# EAGLE design quadcopter (EAGLE 9.7.0)
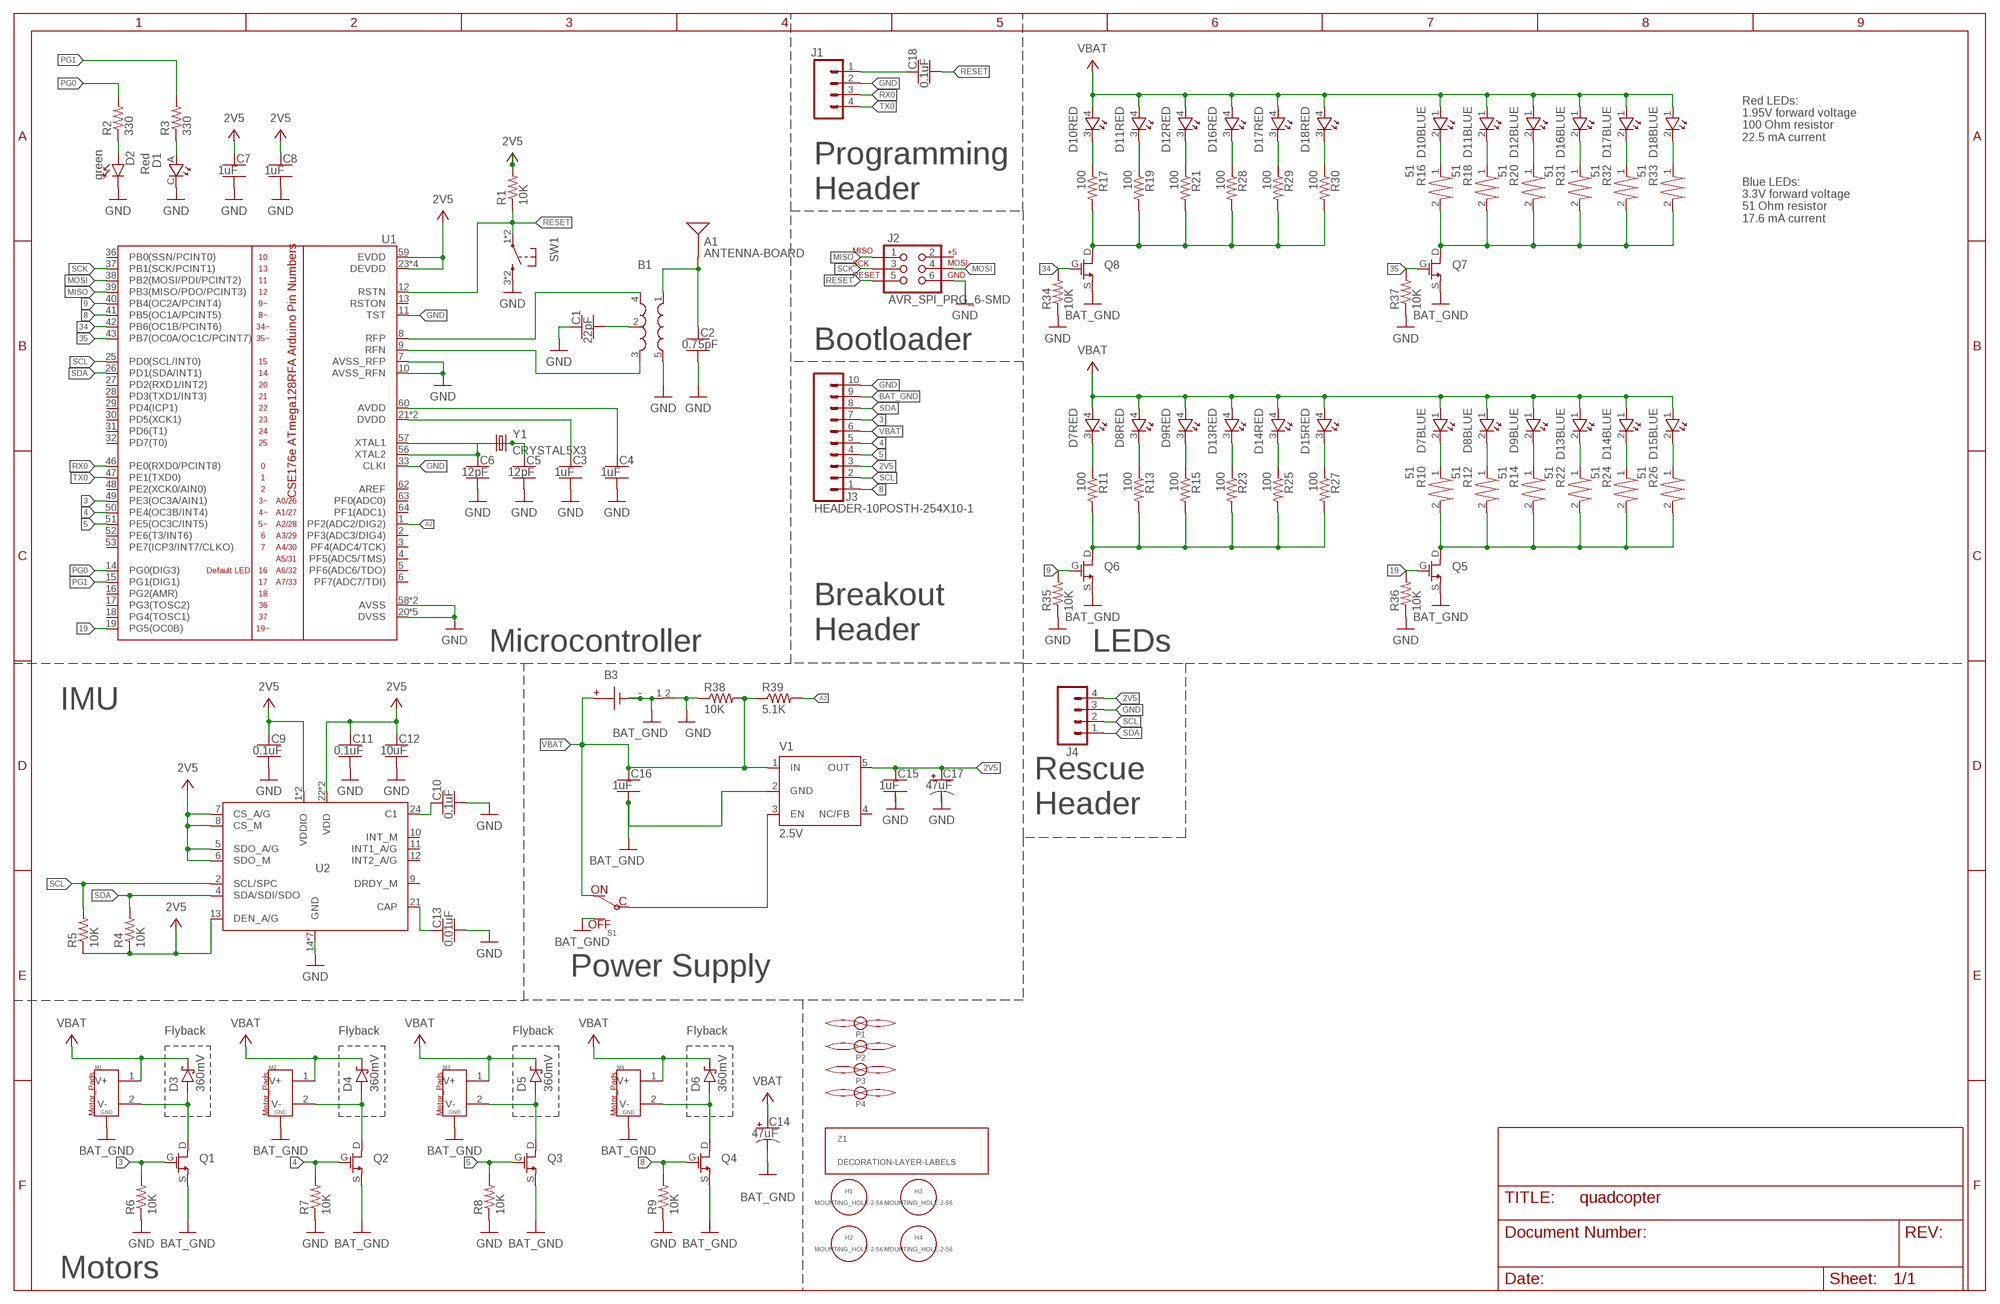
[diagram p0: schematic, sheet 1]
FRAME1 (FRAME_B_L): CREATOR: Unknown; DIST: Unknown; DISTPN: Unknown

## Parts
A1  ANTENNA-BOARD  [ANT_PCB_2.4GHZ_NRF8001_1.6MM_1OZ]
B1  BALUN0805  [BALUN]
B3  BATTERY-SMD-TH  [BATTERY-COMBO]
C1  22pF  CAPACITOR-NP_SMD-2012-0805_CERAMIC-22PF  [CAPC2012X140_HS]
C2  0.75pF  CAPACITOR-NP_SMD-2012-0805_CERAMIC-0.75PF  [CAPC2012X140_HS]
C3  1uF  CAPACITOR-NP_SMD-2012-0805_CERAMIC-1UF  [CAPC2012X140_HS]
C4  1uF  CAPACITOR-NP_SMD-2012-0805_CERAMIC-1UF  [CAPC2012X140_HS]
C5  12pF  CAPACITOR-NP_SMD-2012-0805_CERAMIC-12PF  [CAPC2012X140_HS]
C6  12pF  CAPACITOR-NP_SMD-2012-0805_CERAMIC-12PF  [CAPC2012X140_HS]
C7  1uF  CAPACITOR-NP_SMD-2012-0805_CERAMIC-1UF  [CAPC2012X140_HS]
C8  1uF  CAPACITOR-NP_SMD-2012-0805_CERAMIC-1UF  [CAPC2012X140_HS]
C9  0.1uF  CAPACITOR-NP_SMD-2012-0805_CERAMIC-0.1UF  [CAPC2012X140_HS]
C10  0.1uF  CAPACITOR-NP_SMD-2012-0805_CERAMIC-0.1UF  [CAPC2012X140_HS]
C11  0.1uF  CAPACITOR-NP_SMD-2012-0805_CERAMIC-0.1UF  [CAPC2012X140_HS]
C12  10uF  CAPACITOR-NP_SMD-2012-0805_CERAMIC-10UF  [CAPC2012X140_HS]
C13  0.01uF  CAPACITOR-NP_SMD-2012-0805_CERAMIC-0.01UF  [CAPC2012X140_HS]
C14  47uF  CAPACITOR-POL_47UF-SMD-1206-TAJA  [CAPMP3216X180]
C15  1uF  CAPACITOR-NP_SMD-2012-0805_CERAMIC-1UF  [CAPC2012X140_HS]
C16  1uF  CAPACITOR-NP_SMD-2012-0805_CERAMIC-1UF  [CAPC2012X140_HS]
C17  47uF  CAPACITOR-POL_47UF-SMD-1206-TAJA  [CAPMP3216X180]
C18  0.1uF  CAPACITOR-NP_SMD-2012-0805_CERAMIC-0.1UF  [CAPC2012X140_HS]
D1  Red  LED-RED-0805  [0805_LED]
D2  green  DIODE-LED_SMD-2012-0805-GREEN  [LEDSC125X200X120-2_HS]
D3  360mV  DIODE-SCHOTTKY_-SMD-SOD123  [SODFL3516X96]
D4  360mV  DIODE-SCHOTTKY_-SMD-SOD123  [SODFL3516X96]
D5  360mV  DIODE-SCHOTTKY_-SMD-SOD123  [SODFL3516X96]
D6  360mV  DIODE-SCHOTTKY_-SMD-SOD123  [SODFL3516X96]
D7  DUAL_LED0805_RB_LED  [0805_RB_LED]
D8  DUAL_LED0805_RB_LED  [0805_RB_LED]
D9  DUAL_LED0805_RB_LED  [0805_RB_LED]
D10  DUAL_LED0805_RB_LED  [0805_RB_LED]
D11  DUAL_LED0805_RB_LED  [0805_RB_LED]
D12  DUAL_LED0805_RB_LED  [0805_RB_LED]
D13  DUAL_LED0805_RB_LED  [0805_RB_LED]
D14  DUAL_LED0805_RB_LED  [0805_RB_LED]
D15  DUAL_LED0805_RB_LED  [0805_RB_LED]
D16  DUAL_LED0805_RB_LED  [0805_RB_LED]
D17  DUAL_LED0805_RB_LED  [0805_RB_LED]
D18  DUAL_LED0805_RB_LED  [0805_RB_LED]
H1  MOUNTING_HOLE-2-56  [2-56-MOUNTING-HOLE-NO-METAL]
H2  MOUNTING_HOLE-2-56  [2-56-MOUNTING-HOLE-NO-METAL]
H3  MOUNTING_HOLE-2-56  [2-56-MOUNTING-HOLE-NO-METAL]
H4  MOUNTING_HOLE-2-56  [2-56-MOUNTING-HOLE-NO-METAL]
J1  HEADER-4POS-0.1IN-FEMALE-SMD-BOTTOM-ENTRY  [HEADER-1X4-BOTTOM-ENTRY]
J2  AVR_SPI_PRG_6-SMD  [2X3-SMD]
J3  HEADER-10POSTH-254X10-1  [HDRV10W63P254_10X1_2540X254H838_HS]
J4  HEADER-4POS-0.1IN-FEMALE  [HDRVR4W80P254_1X4_1066X254X850B]
M1  MOTOR_PADS_GND-MOLEX-SMD  [MOLEX-0532610271]
M2  MOTOR_PADS_GND-MOLEX-SMD  [MOLEX-0532610271]
M3  MOTOR_PADS_GND-MOLEX-SMD  [MOLEX-0532610271]
M4  MOTOR_PADS_GND-MOLEX-SMD  [MOLEX-0532610271]
P1  PROPELLOR-45MM  [MOTOR_AND_PROP]
P2  PROPELLOR-45MM  [MOTOR_AND_PROP]
P3  PROPELLOR-45MM  [MOTOR_AND_PROP]
P4  PROPELLOR-45MM  [MOTOR_AND_PROP]
Q1  NMOSFETSI2302CDS-T1-E3CT-ND  [SOT23_MOSFET]
Q2  NMOSFETSI2302CDS-T1-E3CT-ND  [SOT23_MOSFET]
Q3  NMOSFETSI2302CDS-T1-E3CT-ND  [SOT23_MOSFET]
Q4  NMOSFETSI2302CDS-T1-E3CT-ND  [SOT23_MOSFET]
Q5  NMOSFETSI2302CDS-T1-E3CT-ND  [SOT23_MOSFET]
Q6  NMOSFETSI2302CDS-T1-E3CT-ND  [SOT23_MOSFET]
Q7  NMOSFETSI2302CDS-T1-E3CT-ND  [SOT23_MOSFET]
Q8  NMOSFETSI2302CDS-T1-E3CT-ND  [SOT23_MOSFET]
R1  10K  RESISTOR_SMD-2012-0805-10K  [RESC2012X60_HS]
R2  330  RESISTOR_SMD-2012-0805-330  [RESC2012X60_HS]
R3  330  RESISTOR_SMD-2012-0805-330  [RESC2012X60_HS]
R4  10K  RESISTOR_SMD-2012-0805-10K  [RESC2012X60_HS]
R5  10K  RESISTOR_SMD-2012-0805-10K  [RESC2012X60_HS]
R6  10K  RESISTOR_SMD-2012-0805-10K  [RESC2012X60_HS]
R7  10K  RESISTOR_SMD-2012-0805-10K  [RESC2012X60_HS]
R8  10K  RESISTOR_SMD-2012-0805-10K  [RESC2012X60_HS]
R9  10K  RESISTOR_SMD-2012-0805-10K  [RESC2012X60_HS]
R10  51  RESISTOR-0805-51OHM  [0805_RESISTOR]
R11  100  RESISTOR_SMD-2012-0805-100  [RESC2012X60_HS]
R12  51  RESISTOR-0805-51OHM  [0805_RESISTOR]
R13  100  RESISTOR_SMD-2012-0805-100  [RESC2012X60_HS]
R14  51  RESISTOR-0805-51OHM  [0805_RESISTOR]
R15  100  RESISTOR_SMD-2012-0805-100  [RESC2012X60_HS]
R16  51  RESISTOR-0805-51OHM  [0805_RESISTOR]
R17  100  RESISTOR_SMD-2012-0805-100  [RESC2012X60_HS]
R18  51  RESISTOR-0805-51OHM  [0805_RESISTOR]
R19  100  RESISTOR_SMD-2012-0805-100  [RESC2012X60_HS]
R20  51  RESISTOR-0805-51OHM  [0805_RESISTOR]
R21  100  RESISTOR_SMD-2012-0805-100  [RESC2012X60_HS]
R22  51  RESISTOR-0805-51OHM  [0805_RESISTOR]
R23  100  RESISTOR_SMD-2012-0805-100  [RESC2012X60_HS]
R24  51  RESISTOR-0805-51OHM  [0805_RESISTOR]
R25  100  RESISTOR_SMD-2012-0805-100  [RESC2012X60_HS]
R26  51  RESISTOR-0805-51OHM  [0805_RESISTOR]
R27  100  RESISTOR_SMD-2012-0805-100  [RESC2012X60_HS]
R28  100  RESISTOR_SMD-2012-0805-100  [RESC2012X60_HS]
R29  100  RESISTOR_SMD-2012-0805-100  [RESC2012X60_HS]
R30  100  RESISTOR_SMD-2012-0805-100  [RESC2012X60_HS]
R31  51  RESISTOR-0805-51OHM  [0805_RESISTOR]
R32  51  RESISTOR-0805-51OHM  [0805_RESISTOR]
R33  51  RESISTOR-0805-51OHM  [0805_RESISTOR]
R34  10K  RESISTOR_SMD-2012-0805-10K  [RESC2012X60_HS]
R35  10K  RESISTOR_SMD-2012-0805-10K  [RESC2012X60_HS]
R36  10K  RESISTOR_SMD-2012-0805-10K  [RESC2012X60_HS]
R37  10K  RESISTOR_SMD-2012-0805-10K  [RESC2012X60_HS]
R38  10K  RESISTOR_SMD-2012-0805-10K  [RESC2012X60_HS]
R39  5.1K  RESISTOR_SMD-2012-0805-5.1K  [RESC2012X60_HS]
S1  POWER-SWITCH-MFS201N-9-Z-SMD-EDGE  [JS102011SAQN]
SW1  PUSHBUTTON_-4.5X4.5  [4.5MM_TACTILE_SWITCH_TL3305AF160QG]
U1  ATMEGA128RFA1  [QFN-64]
U2  IMU_LSM9DS1LSM9DS1  [IMU_LSM9DS1]
V1  2.5V  TPS73633-DBVT2.5V  [SOT23-DBV]
W1  NET_BRIDGENET_BRIDGE  [NET_BRIDGE]
Y1  CRYSTAL5X3  [CRYSTAL-SMD-5X3]
Z1  DECORATION-LAYER-LABELS  [LAYER_LABELS]

## Nets
2V5 [PWR]: C7.1 C8.1 C9.1 C11.1 C12.1 C15.1 C17.1(+) J3.3 J4.4 R1.2 R4.1 R5.1 U1.23(DEVDD) U1.34(DEVDD) U1.44(DEVDD) U1.54(DEVDD) U1.59(EVDD) U2.1(VDDIO) U2.3(VDDIO) U2.5(SDO_A/G) U2.6(SDO_M) U2.7(CS_A/G) U2.8(CS_M) U2.13(DEN_A/G) U2.22(VDD) U2.23(VDD) V1.5(OUT)
3: J3.7 Q1.G R6.2 U1.49(PE3(OC3A/AIN1))
4: J3.5 Q2.G R7.2 U1.50(PE4(OC3B/INT4))
5: J3.4 Q3.G R8.2 U1.51(PE5(OC3C/INT5))
8: J3.1 Q4.G R9.2 U1.41(PB5(OC1A/PCINT5))
9: Q6.G R35.2 U1.40(PB4(OC2A/PCINT4))
19: Q5.G R36.2 U1.19(PG5(OC0B))
34: Q8.G R34.2 U1.42(PB6(OC1B/PCINT6))
35: Q7.G R37.2 U1.43(PB7(OC0A/OC1C/PCINT7))
A2: R39.2 U1.1(PF2(ADC2/DIG2))
ADRV [RFSIG]: A1.FEED(SIGNAL) B1.1(IN) C2.1
BAT_GND [HIGHCURRENT]: B3.2(N) B3.G2(N) B3.G3(N) B3.G(N) C14.2(-) C16.2 J3.9 M1.G1(GND) M1.G2(GND) M2.G1(GND) M2.G2(GND) M3.G1(GND) M3.G2(GND) M4.G1(GND) M4.G2(GND) Q1.S Q2.S Q3.S Q4.S Q5.S Q6.S Q7.S Q8.S S1.A(OFF) V1.2(GND) W1.1(PAD_1)
GND [PWR]: B1.5(GND) C1.1 C2.2 C3.2 C4.2 C5.2 C6.2 C7.2 C8.2 C9.2 C10.2 C11.2 C12.2 C13.2 C15.2 C17.2(-) D1.C D2.C J1.2 J2.6 J3.10 J4.3 R6.1 R7.1 R8.1 R9.1 R34.1 R35.1 R36.1 R37.1 R38.1 SW1.3 SW1.4 U1.7(AVSS_RFP) U1.10(AVSS_RFN) U1.11(TST) U1.20(DVSS) U1.24(DVSS) U1.33(CLKI) U1.35(DVSS) U1.45(DVSS) U1.55(DVSS) U1.58(AVSS) U1.61(AVSS) U2.14(GND) U2.15(GND) U2.16(GND) U2.17(GND) U2.18(GND) U2.19(GND) U2.20(GND) W1.2(PAD_2)
MISO: J2.1 U1.39(PB3(MISO/PDO/PCINT3))
MOSI: J2.4 U1.38(PB2(MOSI/PDI/PCINT2))
N$1: S1.C V1.3(EN)
N$3: B1.2(GND) C1.2
N$5: C4.1 U1.60(AVDD)
N$6: C3.1 U1.21(DVDD) U1.22(DVDD)
N$7: C5.1 U1.57(XTAL1) Y1.3
N$8: C6.1 U1.56(XTAL2) Y1.1
N$9: D2.A R2.1
N$10: D1.A R3.1
N$11 [HIGHCURRENT]: D3.2(A) M1.2(V-) Q1.D
N$12: C10.1 U2.24(C1)
N$13 [HIGHCURRENT]: D4.2(A) M2.2(V-) Q2.D
N$14: C13.1 U2.21(CAP)
N$15 [HIGHCURRENT]: D5.2(A) M3.2(V-) Q3.D
N$16 [HIGHCURRENT]: D6.2(A) M4.2(V-) Q4.D
N$17: D10.3(RED:C) R17.1
N$18: D7.3(RED:C) R11.1
N$19: Q8.D R17.2 R19.2 R21.2 R28.2 R29.2 R30.2
N$20: Q5.D R10.2 R12.2 R14.2 R22.2 R24.2 R26.2
N$21: D7.2(BLUE:C) R10.1
N$22: Q6.D R11.2 R13.2 R15.2 R23.2 R25.2 R27.2
N$23: Q7.D R16.2 R18.2 R20.2 R31.2 R32.2 R33.2
N$24: D8.3(RED:C) R13.1
N$25: C18.1 J1.1
N$26: D8.2(BLUE:C) R12.1
N$27: D13.3(RED:C) R23.1
N$28: D9.3(RED:C) R15.1
N$29: D10.2(BLUE:C) R16.1
N$30: D9.2(BLUE:C) R14.1
N$31: D13.2(BLUE:C) R22.1
N$32: D14.3(RED:C) R25.1
N$33: D11.3(RED:C) R19.1
N$34: D11.2(BLUE:C) R18.1
N$35: D12.3(RED:C) R21.1
N$36: D12.2(BLUE:C) R20.1
N$37: D14.2(BLUE:C) R24.1
N$38: D15.3(RED:C) R27.1
N$39: D15.2(BLUE:C) R26.1
N$40: D16.3(RED:C) R28.1
N$41: D17.3(RED:C) R29.1
N$42: D18.3(RED:C) R30.1
N$43: D16.2(BLUE:C) R31.1
N$44: D17.2(BLUE:C) R32.1
N$45: D18.2(BLUE:C) R33.1
PG0: R2.2 U1.14(PG0(DIG3))
PG1: R3.2 U1.15(PG1(DIG1))
RESET: C18.2 J2.5 R1.1 SW1.1 SW1.2 U1.12(RSTN)
RF_N: B1.3(OUT2) U1.9(RFN)
RF_P: B1.4(OUT1) U1.8(RFP)
RX0: J1.3 U1.46(PE0(RXD0/PCINT8))
SCK: J2.3 U1.37(PB1(SCK/PCINT1))
SCL: J3.2 J4.2 R5.2 U1.25(PD0(SCL/INT0)) U2.2(SCL/SPC)
SDA: J3.8 J4.1 R4.2 U1.26(PD1(SDA/INT1)) U2.4(SDA/SDI/SDO)
TX0: J1.4 U1.47(PE1(TXD0))
VBAT [HIGHCURRENT]: B3.1(P) B3.P C14.1(+) C16.1 D3.1(C) D4.1(C) D5.1(C) D6.1(C) D7.1(BLUE:A) D7.4(RED:A) D8.1(BLUE:A) D8.4(RED:A) D9.1(BLUE:A) D9.4(RED:A) D10.1(BLUE:A) D10.4(RED:A) D11.1(BLUE:A) D11.4(RED:A) D12.1(BLUE:A) D12.4(RED:A) D13.1(BLUE:A) D13.4(RED:A) D14.1(BLUE:A) D14.4(RED:A) D15.1(BLUE:A) D15.4(RED:A) D16.1(BLUE:A) D16.4(RED:A) D17.1(BLUE:A) D17.4(RED:A) D18.1(BLUE:A) D18.4(RED:A) J3.6 M1.1(V+) M2.1(V+) M3.1(V+) M4.1(V+) R38.2 R39.1 S1.B(ON) V1.1(IN)
Unconnected: J2.2 U1.2(PF3(ADC3/DIG4)) U1.3(PF4(ADC4/TCK)) U1.4(PF5(ADC5/TMS)) U1.5(PF6(ADC6/TDO)) U1.6(PF7(ADC7/TDI)) U1.13(RSTON) U1.16(PG2(AMR)) U1.17(PG3(TOSC2)) U1.18(PG4(TOSC1)) U1.27(PD2(RXD1/INT2)) U1.28(PD3(TXD1/INT3)) U1.29(PD4(ICP1)) U1.30(PD5(XCK1)) U1.31(PD6(T1)) U1.32(PD7(T0)) U1.36(PB0(SSN/PCINT0)) U1.48(PE2(XCK0/AIN0)) U1.52(PE6(T3/INT6)) U1.53(PE7(ICP3/INT7/CLKO)) U1.62(AREF) U1.63(PF0(ADC0)) U1.64(PF1(ADC1)) U2.9(DRDY_M) U2.10(INT_M) U2.11(INT1_A/G) U2.12(INT2_A/G) V1.4(NC/FB)

## Notes on the sheet
- Red LEDs: 
  1.95V forward voltage
  100 Ohm resistor
  22.5 mA current
- Programming
  Header
- Blue LEDs:
  3.3V forward voltage
  51 Ohm resistor
  17.6 mA current
- Bootloader
- Breakout
  Header
- Microcontroller | LEDs
- IMU
- Rescue
  Header
- Power Supply
- Flyback | Flyback | Flyback | Flyback
- Motors

## Library data of the parts
A1 = quadparts_prebuilt_2022:ANTENNA: Single endded antenna.; CREATOR: Swanson; DESC: trace antenna; DIST: NA; DISTPN: NA; MFR: NA; MOUNTING: NONE; MPN: NA; POPULATE: NO
B1 = quadparts_prebuilt_2022:BALUN: A balun to convert differential radio-frequency outputs from the microcontroller into a single-ended driver for the antenna.; CREATOR: Swanson; DATASHEET: http://katalog.we-online.de/pbs/datasheet/748421245.pdf; DESC: BALUN 2.4GHZ-2.5GHZ 50/100 0805; DIST: Digikey; DISTPN: 732-2230-1-ND; MFR: Wurth Electronics Inc.; MOUNTING: SMD; MPN: 748421245; PACKAGE: 0805; PRICE: 2.63; REVIEWER: Swanson
B3 = quadparts_prebuilt_2022:BATTERY: Connections for a battery.
C1 = quadparts_prebuilt_2022:CAPACITOR-NP_: Nonpolarized capacitor; CREATOR: Swanson; DESC: CAP CER 22PF 250V C0G/NP0 0805; DIST: Digikey; DISTPN: 490-5534-1-ND; MFR: Murata Electronics; MOUNTING: SMD; MPN: GRM21A5C2E220JW01D; PACKAGE: 0805; REVIEWER: Swanson
C2 = quadparts_prebuilt_2022:CAPACITOR-NP_: Nonpolarized capacitor; CREATOR: Swanson; DESC: CAP CER 0.75PF 100V C0G/NP0 0805; DIST: Digikey; DISTPN: 490-3585-1-ND; MFR: Murata Electronics; MOUNTING: SMD; MPN: GQM2195C2AR75CB01D; PACKAGE: 0805; REVIEWER: Swanson
C3 C4 C7 C8 C15 C16 = quadparts_prebuilt_2022:CAPACITOR-NP_: Nonpolarized capacitor; CREATOR: Swanson; DIST: Digikey; DISTPN: 587-1281-1-ND; MFR: Taiyo Yuden; MOUNTING: SMD; MPN: TMK212B7105KG-T; REVIEWER: Swanson
C5 C6 = quadparts_prebuilt_2022:CAPACITOR-NP_: Nonpolarized capacitor; CREATOR: Swanson; DESC: CAP CER 12PF 250V C0G/NP0 0805; DIST: Digikey; DISTPN: 490-5531-1-ND; MFR: Murata Electronics; MOUNTING: SMD; MPN: GRM21A5C2E120JW01D; PACKAGE: 0805; REVIEWER: Swanson
C9-C11 C18 = quadparts_prebuilt_2022:CAPACITOR-NP_: Nonpolarized capacitor; CREATOR: Swanson; DESC: CAP CER 0.1UF 100V X7R 0805; DIST: Digikey; DISTPN: 445-1418-1-ND; MFR: TDK Corporation; MOUNTING: SMD; MPN: C2012X7R2A104K125AA; PACKAGE: 0805; REVIEWER: Swanson
C12 = quadparts_prebuilt_2022:CAPACITOR-NP_: Nonpolarized capacitor; CREATOR: Swanson; DESC: CAP CER 10UF 25V X5R 0805; DIST: Digikey; DISTPN: 445-5984-1-ND; MFR: TDK; MOUNTING: SMD; MPN: C2012X5R1E106K125AB; REVIEWER: Swanson
C13 = quadparts_prebuilt_2022:CAPACITOR-NP_: Nonpolarized capacitor; CREATOR: Swanson; DIST: Digikey; DISTPN: 1608-1458-1-ND; MFR: Knowles Syfer; MOUNTING: SMD; MPN: 0805J0500104KJT; REVIEWER: Swanson
C14 C17 = quadparts_prebuilt_2022:CAPACITOR-POL_: Polarized capacitor; CREATOR: Swanson; DESC: CAP TANT 47UF 10% 6.3V 1206; DIST: DIGIKEY; DISTPN: 478-11462-1-ND; MFR: AVX Corporation; MOUNTING: SMD; MPN: TAJA476K006SNJV; PACKAGE: 1206
D1 = custom_rye:LED; CREATOR: Rye Gleason; DIST: Digikey; DISTPN: LTST-C170EKT
D2 = quadparts_prebuilt_2022:DIODE-LED_: Light emitting diode; CREATOR: Swanson; DIST: Digikey; DISTPN: 160-1179-1-ND; MFR: Lite-On Inc; MOUNTING: SMD; MPN: LTST-C170GKT; REVIEWER: Swanson
D3-D6 = quadparts_prebuilt_2022:DIODE-SCHOTTKY_: Schottky diode; CREATOR: Swanson; DESC: DIODE SCHOTTKY 30V 1.5A SFLAT; DIST: Digikey; DISTPN: CRS08QMCT-ND; MFR: Toshiba Semiconductor and Storage; MOUNTING: SMD; MPN: CRS08(TE85L,Q,M); REVIEWER: Swanson
D7-D18 = LED:DUAL_LED; CREATOR: Rye Gleason; DIST: Digikey; DISTPN: 754-1506-1-ND
H1-H4 = quadparts_prebuilt_2022:MOUNTING_HOLE
J1 = quadparts_prebuilt_2022:HEADER-4POS; CREATOR: Swanson; DESC: CONN RCPT 4POS 0.1 GOLD SMD; DIST: DIGIKEY; DISTPN: A121787CT-ND; MFR: TE Connectivity AMP Connectors; MOUNTING: SMD; MPN: 1241152-4
J2 = quadparts_prebuilt_2022:AVR_SPI_PRG_6: AVR ISP 6 Pin This is the in-system programming (ISP) connector for Atmel Microcontrollers programming.; CREATOR: Swanson; DESC: CONN HEADER SMD 6POS 2.54MM; DIST: Digikey; DISTPN: 609-3487-2-ND; MFR: Amphenol ICC (FCI); MOUNTING: SMD; MPN: 95278-101A06LF
J3 = quadparts_prebuilt_2022:HEADER-10POS: 10 pin single inline pin header, socket, or connector; CREATOR: Swanson; DIST: Digikey; DISTPN: 609-3250-ND; MFR: Amphenol FCI; MOUNTING: TH; MPN: 68000-110HLF; REVIEWER: Swanson
J4 = quadparts_prebuilt_2022:HEADER-4POS; CREATOR: Swanson; DIST: Digikey; DISTPN: S7002-ND
M1-M4 = quadparts_prebuilt_2022:MOTOR_PADS_GND: Connections a brushed motor.; CREATOR: Swanson; DESC: CONN HEADER SMD R/A 2POS 1.25MM; DIST: DIGIKEY; DISTPN: WM7620CT-ND; MFR: Molex; MOUNTING: SMD; MPN: 532610271
P1-P4 = quadparts_prebuilt_2022:PROPELLOR
Q1-Q8 = custom_rye:NMOSFET; CREATOR: Rye Gleason; DIST: Digikey; DISTPN: SI2302CDS-T1-E3CT-ND
R1 R4-R9 R34-R38 = quadparts_prebuilt_2022:RESISTOR_: Resistor; CREATOR: Swanson; DESC: RES SMD 10K OHM 5% 1/8W 0805; DIST: Digikey; DISTPN: 311-10KARCT-ND; MFR: Yageo; MOUNTING: SMD; MPN: RC0805JR-0710KL; PACKAGE: 0805; REVIEWER: Swanson
R2 R3 = quadparts_prebuilt_2022:RESISTOR_: Resistor; CREATOR: Swanson; DIST: Digikey; DISTPN: 311-330ARCT-ND; MFR: Yageo; MOUNTING: SMD; MPN: RC0805JR-07330RL; REVIEWER: Swanson
R10 R12 R14 R16 R18 R20 R22 R24 R26 R31-R33 = custom_rye:RESISTOR; CREATOR: Rye Gleason; DIST: Digikey; DISTPN: 311-51.0CRCT-ND
R11 R13 R15 R17 R19 R21 R23 R25 R27-R30 = quadparts_prebuilt_2022:RESISTOR_: Resistor; CREATOR: Swanson; DIST: Digikey; DISTPN: 311-100ARCT-ND; MFR: Yageo; MOUNTING: SMD; MPN: RC0805JR-07100RL; REVIEWER: Swanson
R39 = quadparts_prebuilt_2022:RESISTOR_: Resistor; CREATOR: Swanson; DIST: Digikey; DISTPN: 311-5.1KARCT-ND; MFR: Yageo; MOUNTING: SMD; MPN: RC0805JR-075K1L; REVIEWER: Swanson
S1 = quadparts_prebuilt_2022:POWER-SWITCH-MFS201N-9-Z; CREATOR: Swanson; DESC: SWITCH SLIDE SPDT 300MA 6V; DIST: DIGIKEY; DISTPN: 401-1999-1-ND; MFR: C&K; MOUNTING: SMD; MPN: JS102011SAQN
SW1 = quadparts_prebuilt_2022:PUSHBUTTON_: "Tactile" or "clicky" button.; CREATOR: Swanson; DESC: SWITCH TACTILE SPST-NO 50MA 12V; DIST: DIGIKEY; DISTPN: EG5350CT-ND; MFR: E-Switch; MOUNTING: SMD; MPN: TL3305AF160QG
U1 = quadparts_prebuilt_2022:ATMEGA128RFA1: ATmega128RFA1 8-bit AVR Microcontroller with Low Power 2.4GHz Transceiver for ZigBee and IEEE 802.15.4; CREATOR: Swanson; DATASHEET: http://www.atmel.com/Images/Atmel-8266-MCU_Wireless-ATmega128RFA1_Datasheet.pdf; DESC: IC RF TXRX+MCU 802.15.4 64VFQFN; DIST: Digikey; DISTPN: ATMEGA128RFA1-ZU-ND; MFR: Microchip Technology; MOUNTING: SMD; MPN: ATMEGA128RFA1-ZU; PACKAGE: QFN; PRICE: 10.21; REVIEWER: Swanson
U2 = custom_rye:IMU_LSM9DS1; CREATOR: Rye Gleason; DIST: Digikey; DISTPN: 497-14946-1-ND
V1 = quadparts_prebuilt_2022:TPS73633-DBVT: LP3985-series voltage regulators.; CREATOR: Swanson; DATASHEET: http://www.ti.com/lit/ds/symlink/lp3985.pdf; DESC: IC REG LINEAR 2.5V 150MA SOT23-5; DIST: Digikey; DISTPN: LP3985IM5X-2.5/NOPBCT-ND; MFR: Texas Instruments; MOUNTING: SMD; MPN: LP3985IM5X-2.5/NOPB; REVIEWER: Swanson
W1 = custom_rye:NET_BRIDGE; CREATOR: Rye Gleason; DIST: Digikey; DISTPN: NA
Y1 = quadparts_prebuilt_2022:CRYSTAL: Crystals to provide clock references for microcontrollers, etc.; CREATOR: Swanson; DATASHEET: http://www.abracon.com/Resonators/abm3b.pdf; DESC: CRYSTAL 16.0000MHZ 18PF SMD; DIST: Digikey; DISTPN: 535-9122-1-ND; MFR: Abracon LLC; MOUNTING: SMD; MPN: ABM3B-16.000MHZ-B2-T; PRICE: 0.68; PROD_ID: XTAL-08218; REVIEWER: Swanson
Z1 = quadparts_prebuilt_2022:DECORATION

## Net classes
1 HIGHCURRENT: width 0.762 mm, drill 0.61 mm
2 PWR: width 0.254 mm
3 RFSIG: width 1.27 mm

## Board
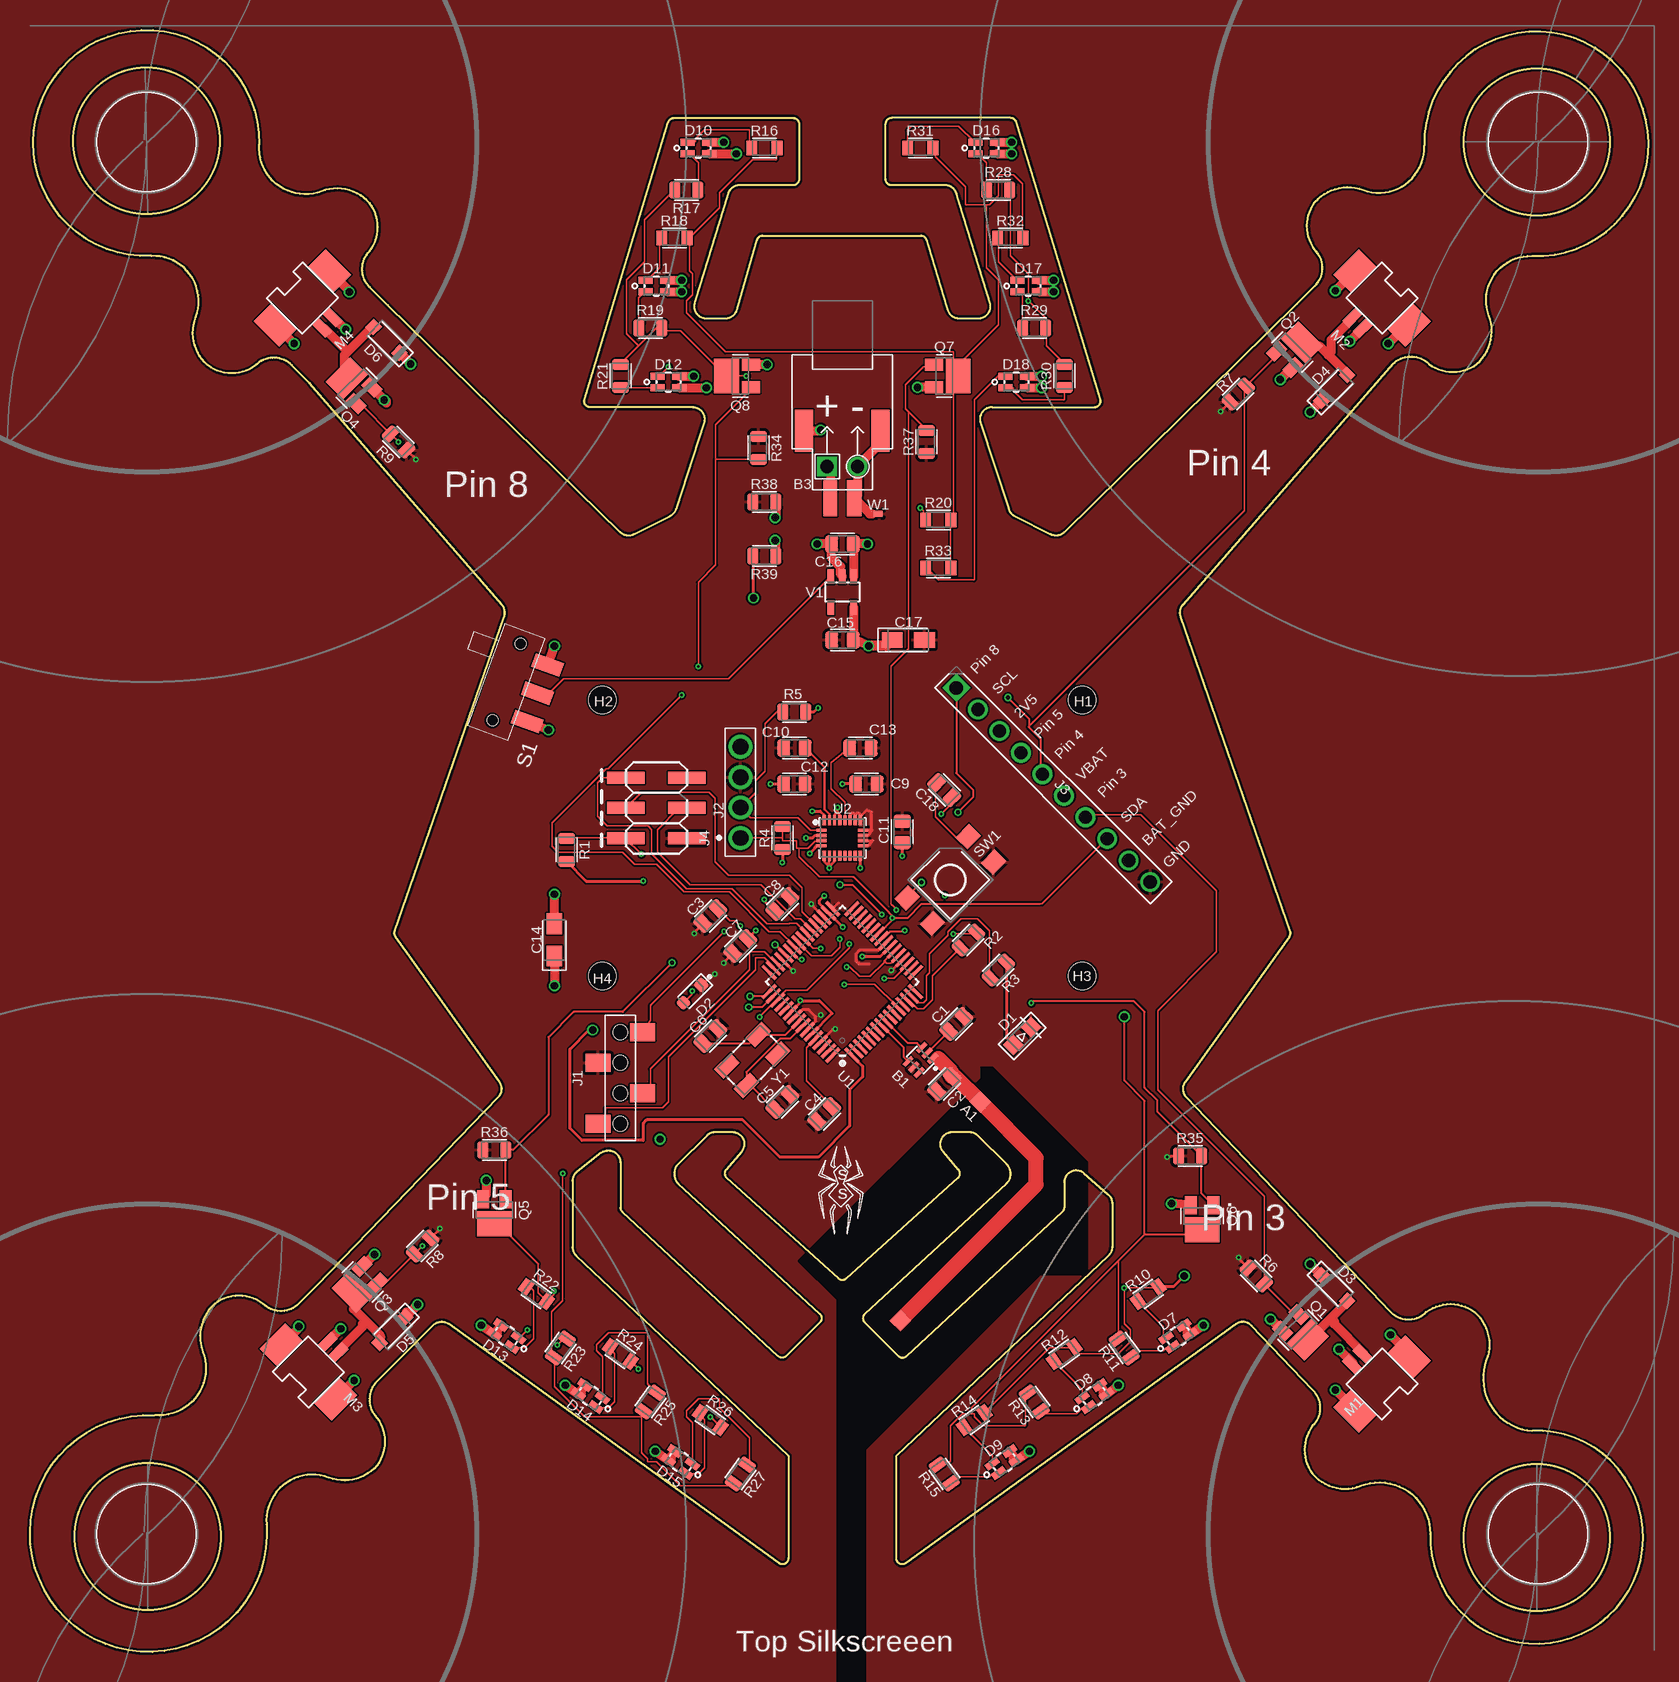
[diagram p1: board, top side]
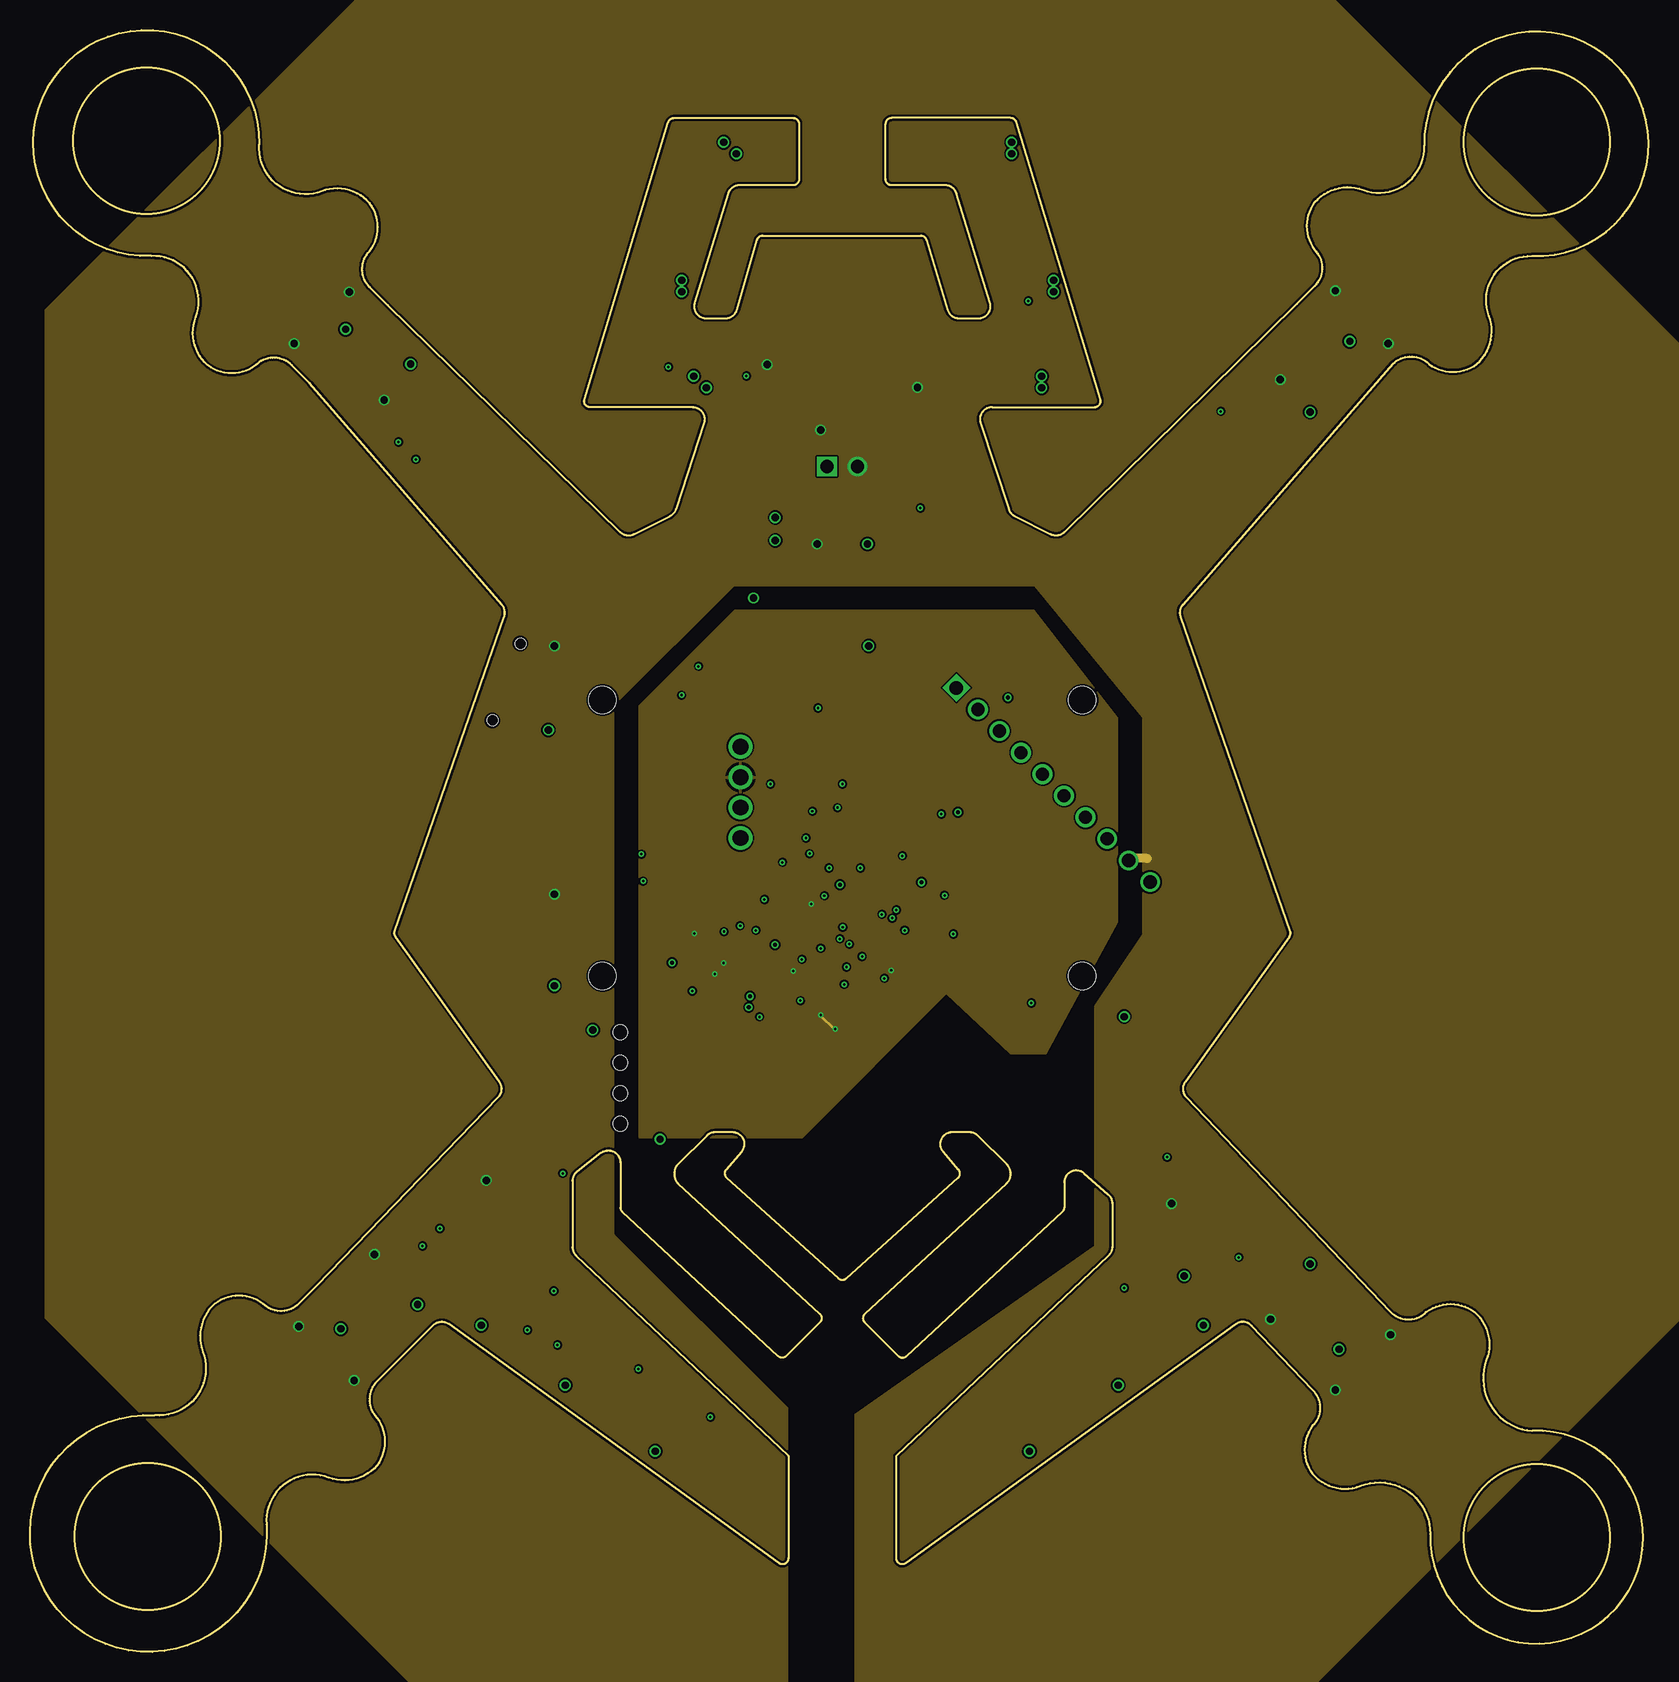
[diagram p2: board, inner layer Route2]
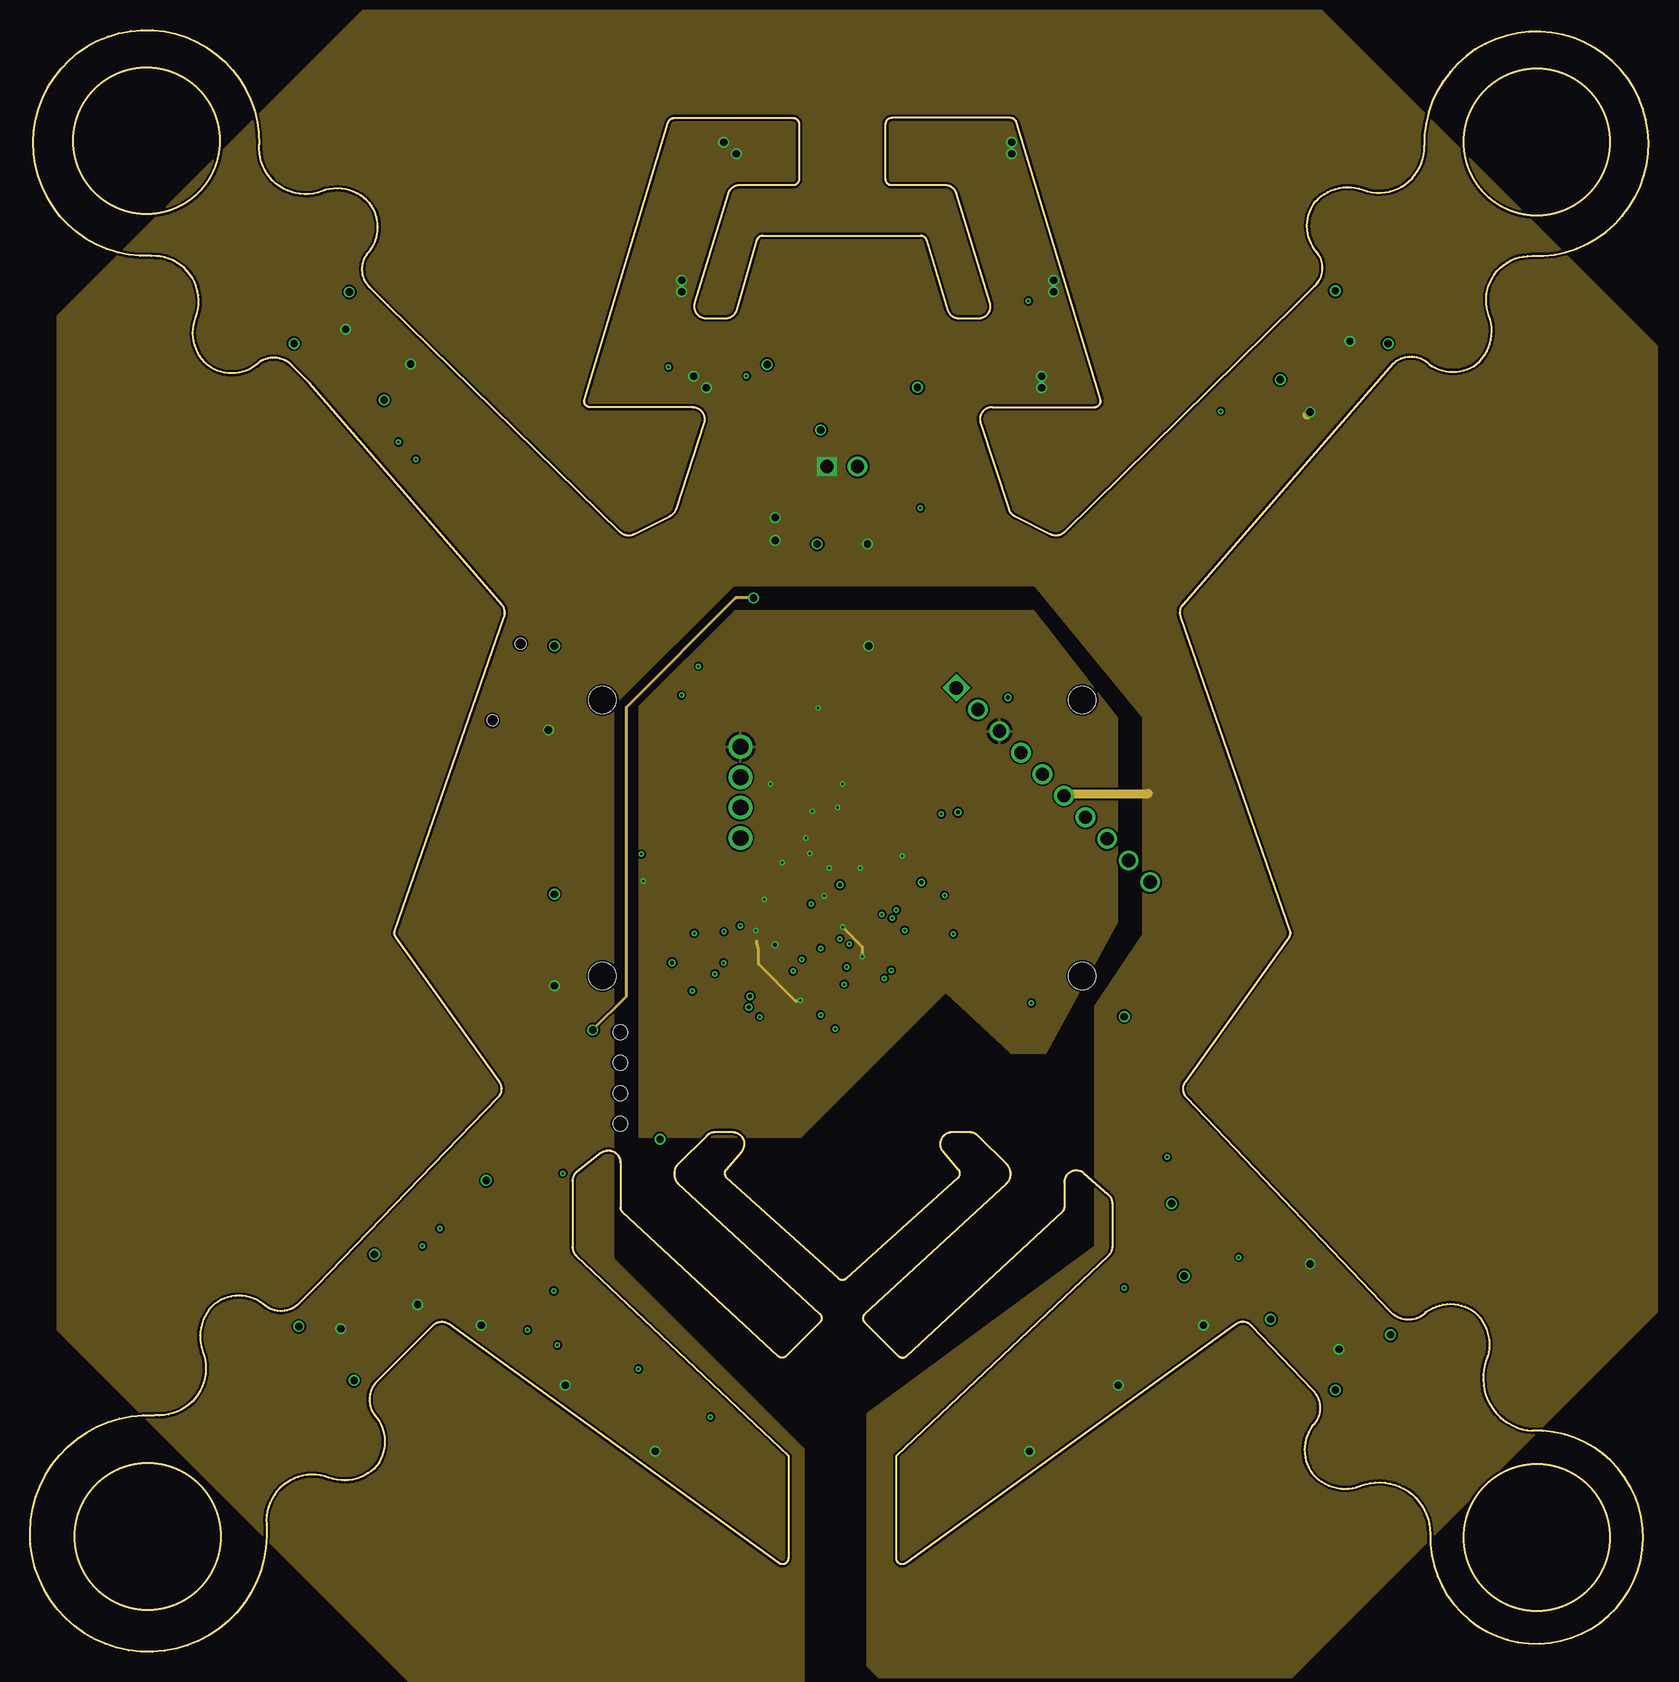
[diagram p3: board, inner layer Route15]
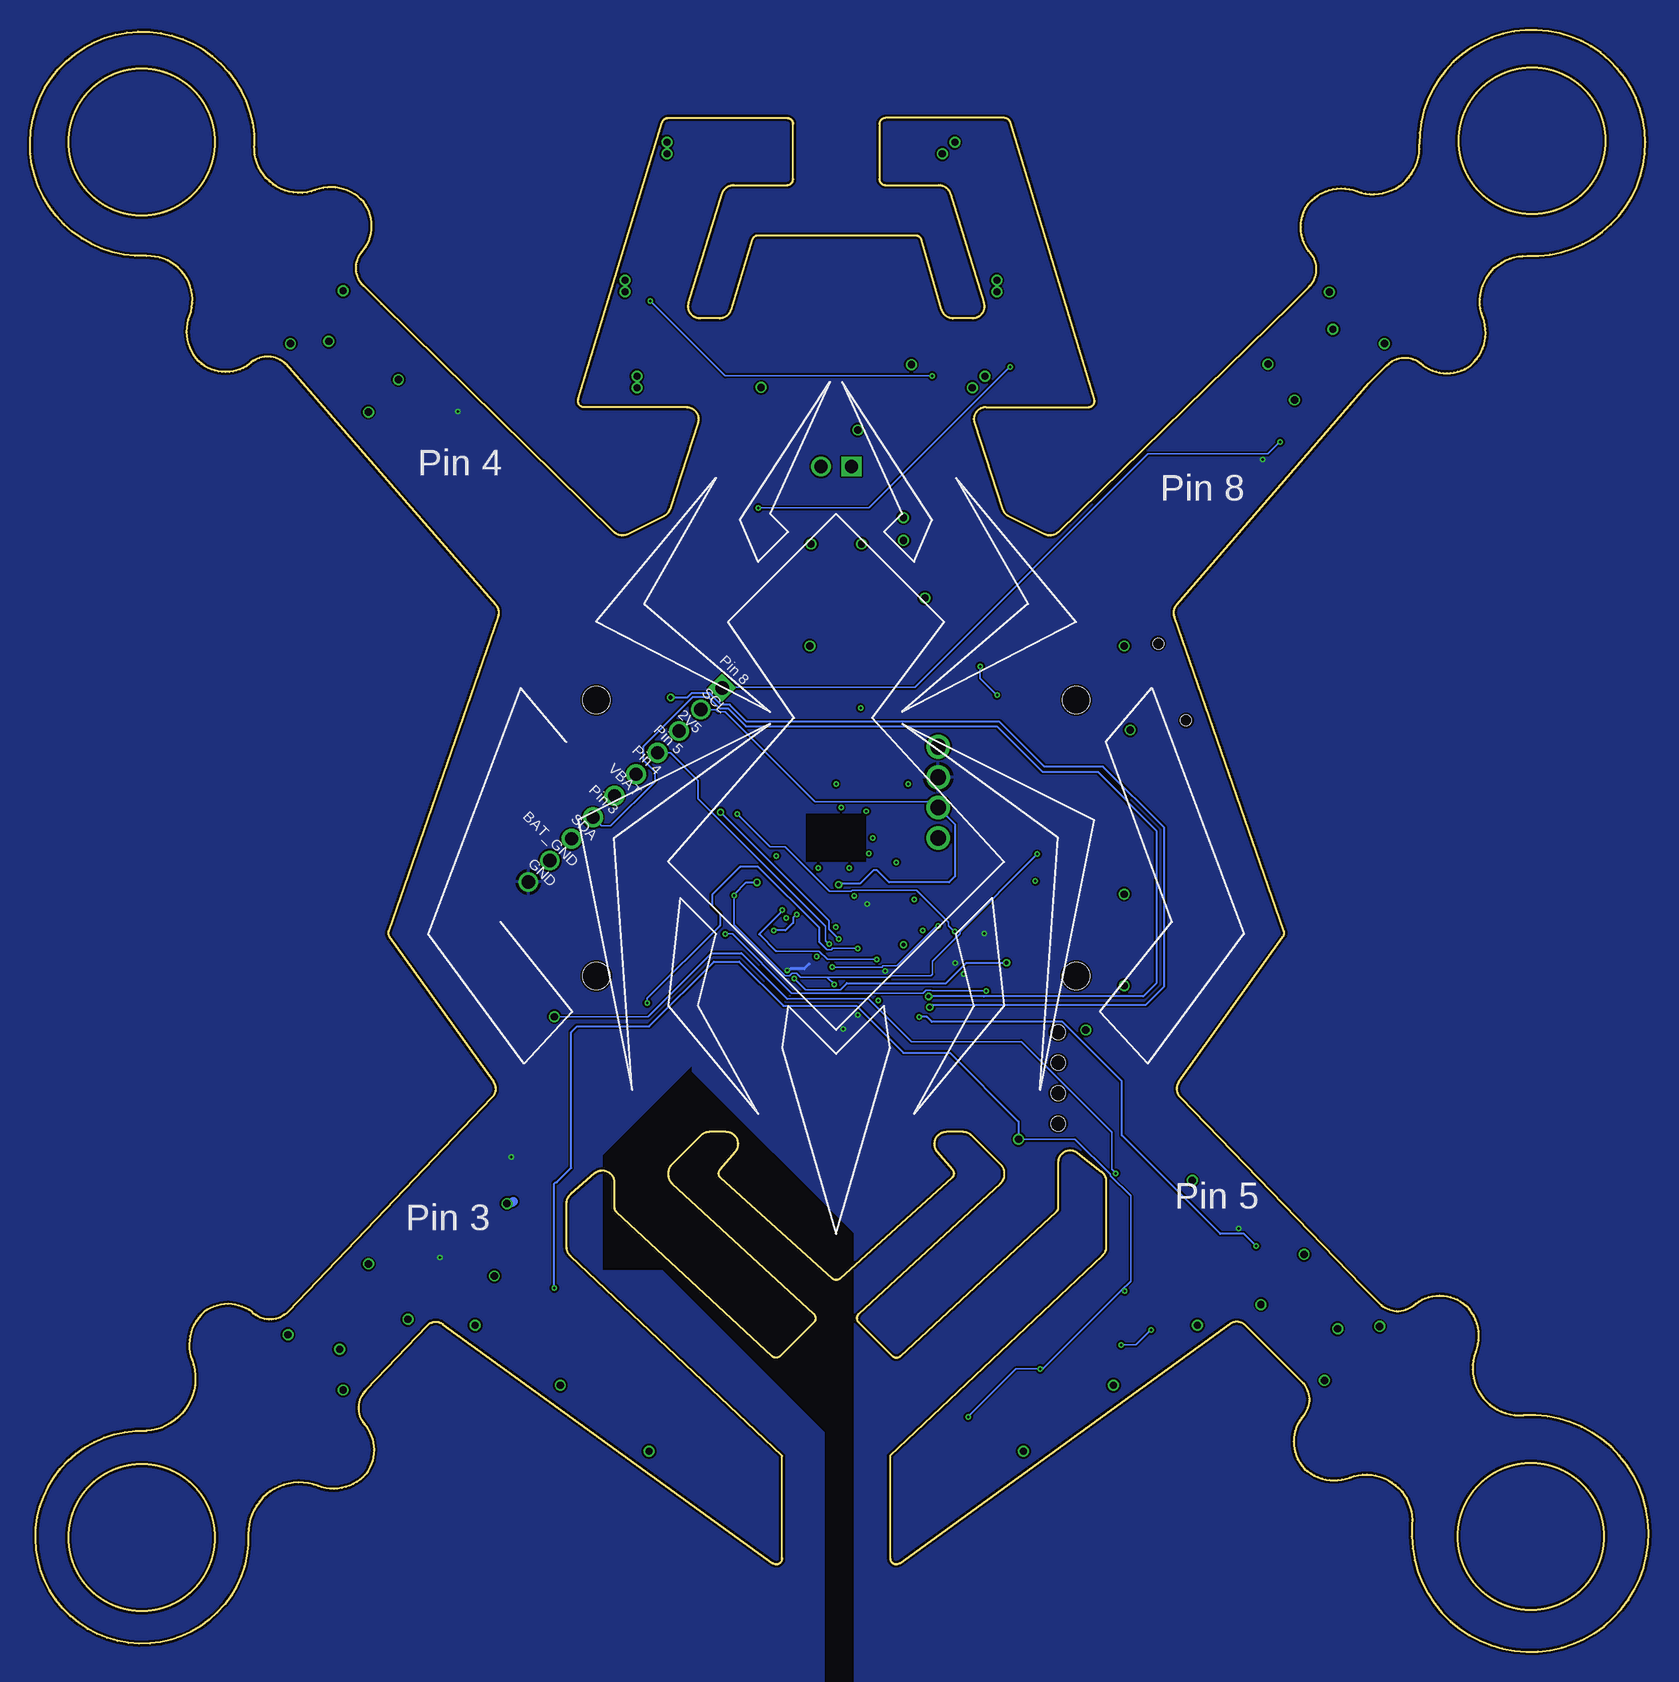
[diagram p4: board, bottom side, seen from below]

Size 134.92 x 135.16 mm. Coordinates in mm from the lower left corner, seen from the top.
Outline: 113.61,107.32 96.1,87.26 arc60 95.91,86.27 105.03,60.07 arc-55 104.96,59.61 96.3,47.5 arc79 96.38,46.22 113.41,28.32 arc90 116.41,28.32 arc-74 120.41,28.32 arc-69 121.41,24.32 arc107 125.21,18.42 arc-274 116.71,9.82 arc112 110.91,13.82 arc-69 106.91,14.82 arc-74 106.91,18.82 arc90 106.91,21.82 101.82,27.19 arc82 100.51,27.31 73.01,7.4 arc-126 72.21,7.8 72.21,16.32 89.9,33.03 arc47 90.21,33.75 90.21,37.37 arc49 89.87,38.12 87.87,39.87 arc131 86.21,39.12 86.21,37.04 arc-47 86.05,36.68 73.07,24.65 arc-88 72.37,24.66 69.58,27.45 arc-92 69.6,28.18 81.39,39.03 arc47 81.71,39.76 81.71,39.91 arc45 81.42,40.62 79.01,43.03 arc45 78.3,43.32 76.89,43.32 arc131 76.13,41.67 77.4,40.19 arc-89 77.35,39.5 68.05,31.12 arc-84 67.38,31.12 58.08,39.5 arc-89 58.03,40.19 59.3,41.67 arc131 58.54,43.32 57.13,43.32 arc45 56.42,43.03 54.01,40.62 arc45 53.71,39.91 53.71,39.76 arc47 54.04,39.03 65.83,28.18 arc-92 65.85,27.45 63.05,24.66 arc-88 62.36,24.65 49.37,36.68 arc-47 49.21,37.04 49.21,40.78 arc128 47.6,41.57 45.6,40.02 arc52 45.21,39.23 45.21,33.75 arc47 45.53,33.03 63.21,16.32 63.21,7.8 arc-126 62.42,7.4 34.91,27.32 arc81 33.61,27.22 28.91,22.52 arc90 28.91,19.52 arc-74 28.91,15.52 arc-69 24.91,14.52 arc115 19.71,10.62 arc-278 10.41,19.72 arc115 14.41,25.02 arc-69 15.41,29.02 arc-74 19.41,29.02 arc90 22.41,29.02 23.91,30.52 39.04,46.22 arc80 39.13,47.5 30.47,59.61 arc-55 30.4,60.07 39.52,86.28 arc60 39.34,87.26 23.31,105.72 21.81,107.22 arc90 18.81,107.22 arc-74 14.81,107.22 arc-69 13.81,111.22 arc113 10.11,116.32 arc-273 19.11,125.62 arc115 24.31,121.72 arc-69 28.31,120.72 arc-74 28.31,116.72 arc90 28.31,113.72 29.81,112.22 49.21,93.32 arc71 50.35,93.14 53.34,94.64 arc45 53.84,95.22 56.19,102.41 arc108 55.24,103.72 46.69,103.72 arc-107 46.21,104.37 53.21,127.47 arc-73 53.69,127.82 63.61,127.82 arc-90 64.11,127.32 64.11,122.72 arc-90 63.61,122.22 59.15,122.22 arc73 58.2,121.52 55.41,112.42 arc107 56.37,111.12 57.96,111.12 arc74 58.92,111.85 60.61,117.66 arc-74 61.09,118.02 74.24,118.02 arc-73 74.72,117.67 76.5,111.83 arc73 77.46,111.12 79.06,111.12 arc107 80.02,112.42 77.23,121.52 arc73 76.27,122.22 71.81,122.22 arc-90 71.31,122.72 71.31,127.32 arc-90 71.81,127.82 81.74,127.82 arc-73 82.22,127.47 89.22,104.37 arc-107 88.74,103.72 80.19,103.72 arc108 79.24,102.41 81.58,95.22 arc45 82.09,94.64 85.08,93.14 arc71 86.22,93.32 105.61,112.32 107.11,113.82 arc90 107.11,116.82 arc-74 107.11,120.82 arc-69 111.11,121.82 arc113 116.21,125.52 arc-273 125.21,116.32 arc113 121.61,111.32 arc-69 120.61,107.32 arc-74 116.61,107.32 arc90 113.61,107.32
Outline: circle at 125.61,125.82 radius 6.1
Outline: circle at 9.71,125.92 radius 6.1
Outline: circle at 9.81,9.62 radius 6.1
Outline: circle at 125.61,9.52 radius 6.1
Copper layers (1*2*15*16): Top 0.035559375mm / dielectric 1.501140625mm / Route2 0.035559375mm / dielectric 0.149859375mm / Route15 0.035559375mm / dielectric 0.200659375mm / Bottom 0.035559375mm
Design rules "pcbcart-4layer-5mil-small-cream": minimum track width 5mil, minimum drill 8mil, track to track 6mil, track to pad 6mil, pad to pad 6mil, via to via 6mil, smd to smd 6mil, copper to edge 0.2mm, drill to drill 10mil, minimum pad ring 5mil, minimum via ring 5mil, stop-mask expansion 3mil, vias tented up to drill 0.45mm, thermal gap 10mil

### Footprints (pad centres in the part's own frame; a part is rotated, then mirrored left to right if it is on the bottom)
ANT_PCB_2.4GHZ_NRF8001_1.6MM_1OZ = smd 1.27 x 1.27: FEED 0,0; TESTPOINT -8.169,17.605
BALUN = smd 0.35 x 1: 1 -0.65,-0.8; 2 0,-0.8; 3 0.65,-0.8; 4 0.65,0.8; 5 0,0.8; 6 -0.65,0.8
BATTERY-COMBO = drill 1.1 square: 1 1.27,2.54 | drill 1.1: 2 -1.27,2.54 | smd 1.2 x 3: G -1,5.2 | smd 1.5 x 3.5: G2 -3.2,-0.45; G3 3.2,-0.45 | smd 1.1 x 3: P 1,5.2
CAPC2012X140_HS = smd 1.08 x 1.42: 1 -0.895,0; 2 0.895,0
CAPMP3216X180 = smd 1.735 x 1.315: 1 -1.34,0; 2 1.34,0
0805_LED = smd 1.2 x 1.2: A -1.05,0; C 1.05,0
LEDSC125X200X120-2_HS = smd 0.94 x 0.99: A -1.045,0; C 1.045,0
SODFL3516X96 = smd 0.962 x 1.029: 1 -1.525,0; 2 1.525,0
0805_RB_LED = smd 1.2 x 0.6: 1 0.9,0.475; 2 -0.9,0.475; 3 -0.9,-0.475; 4 0.9,-0.475
2-56-MOUNTING-HOLE-NO-METAL = hole 2.261: 0,0
HEADER-1X4-BOTTOM-ENTRY = smd 1.5 x 2.1: 1 3.81,-1.85; 2 1.27,1.85; 3 -1.27,-1.85; 4 -3.81,1.85 | hole 1.2: -1.27,0; -3.81,0; 1.27,0; 3.81,0
2X3-SMD = smd 1 x 3.15: 1 -2.54,-2.54; 2 -2.54,2.54; 3 0,-2.54; 4 0,2.54; 5 2.54,-2.54; 6 2.54,2.54
HDRV10W63P254_10X1_2540X254H838_HS = drill 1.1 pad 1.65 square: 1 0,0 | drill 1.1 pad 1.65: 2 2.54,0; 3 5.08,0; 4 7.62,0; 5 10.16,0; 6 12.7,0; 7 15.24,0; 8 17.78,0; 9 20.32,0; 10 22.86,0
HDRVR4W80P254_1X4_1066X254X850B = drill 1.331 pad 1.997: 1 0,0; 2 2.54,0; 3 5.08,0; 4 7.62,0
MOLEX-0532610271 = smd 0.8 x 1.6: 1 -0.637,2.9; 2 0.613,2.9 | smd 2.1 x 3: G1 -3.175,0; G2 3.175,0
SOT23_MOSFET = smd 2.05 x 2.9: D 1.15,0 | smd 1.5 x 1: G -0.875,0.95; S -0.875,-0.95
RESC2012X60_HS = smd 0.92 x 1.38: 1 -0.955,0; 2 0.955,0
0805_RESISTOR = smd 0.9 x 1.2: 1 -1.05,0; 2 1.05,0
JS102011SAQN = smd 1.2 x 2.5: A -2.5,2.75; B 2.5,2.75; C 0,2.75 | hole 0.9: -3.4,0; 3.4,0
4.5MM_TACTILE_SWITCH_TL3305AF160QG = smd 1.6 x 1.4: 1 -3.6,-1.5; 2 3.6,-1.5; 3 -3.6,1.5; 4 3.6,1.5
QFN-64 = smd 1.562 x 0.28: 1 -4.881,3.75; 2 -4.881,3.25; 3 -4.881,2.75; 4 -4.881,2.25; 5 -4.881,1.75; 6 -4.881,1.25; 7 -4.881,0.75; 8 -4.881,0.25; 9 -4.881,-0.25; 10 -4.881,-0.75; 11 -4.881,-1.25; 12 -4.881,-1.75; 13 -4.881,-2.25; 14 -4.881,-2.75; 15 -4.881,-3.25; 16 -4.881,-3.75; 33 4.881,-3.75; 34 4.881,-3.25; 35 4.881,-2.75; 36 4.881,-2.25; 37 4.881,-1.75; 38 4.881,-1.25; 39 4.881,-0.75; 40 4.881,-0.25; 41 4.881,0.25; 42 4.881,0.75; 43 4.881,1.25; 44 4.881,1.75; 45 4.881,2.25; 46 4.881,2.75; 47 4.881,3.25; 48 4.881,3.75 | smd 0.28 x 1.562: 17 -3.75,-4.881; 18 -3.25,-4.881; 19 -2.75,-4.881; 20 -2.25,-4.881; 21 -1.75,-4.881; 22 -1.25,-4.881; 23 -0.75,-4.881; 24 -0.25,-4.881; 25 0.25,-4.881; 26 0.75,-4.881; 27 1.25,-4.881; 28 1.75,-4.881; 29 2.25,-4.881; 30 2.75,-4.881; 31 3.25,-4.881; 32 3.75,-4.881; 49 3.75,4.881; 50 3.25,4.881; 51 2.75,4.881; 52 2.25,4.881; 53 1.75,4.881; 54 1.25,4.881; 55 0.75,4.881; 56 0.25,4.881; 57 -0.25,4.881; 58 -0.75,4.881; 59 -1.25,4.881; 60 -1.75,4.881; 61 -2.25,4.881; 62 -2.75,4.881; 63 -3.25,4.881; 64 -3.75,4.881
IMU_LSM9DS1 = smd 0.275 x 0.86: 1 -1.505,1.48; 6 -1.505,-1.48; 7 -1.075,-1.48; 8 -0.645,-1.48; 9 -0.215,-1.48; 10 0.215,-1.48; 11 0.645,-1.48; 12 1.075,-1.48; 13 1.505,-1.48; 18 1.505,1.48; 19 1.075,1.48; 20 0.645,1.48; 21 0.215,1.48; 22 -0.215,1.48; 23 -0.645,1.48; 24 -1.075,1.48 | smd 0.86 x 0.275: 2 -1.73,0.645; 3 -1.73,0.215; 4 -1.73,-0.215; 5 -1.73,-0.645; 14 1.73,-0.645; 15 1.73,-0.215; 16 1.73,0.215; 17 1.73,0.645
SOT23-DBV = smd 0.55 x 1.2: 1 -0.95,-1.3; 2 0,-1.3; 3 0.95,-1.3; 4 0.95,1.3; 5 -0.95,1.3
NET_BRIDGE = smd 0.5 x 0.5: 1 -0.1,0; 2 0.1,0
CRYSTAL-SMD-5X3 = smd 1.9 x 1.1: 1 -1.85,-1.15; 2 1.85,-1.15; 3 1.85,1.15; 4 -1.85,1.15

### Placement (x,y rotation side)
A1  79.21,45.82 135 top
B1  74.21,49.32 135 top
B3  67.71,101.32 180 top
C1  77.21,52.32 225 top
C2  76.21,47.32 225 top
C3  56.71,61.32 225 top
C4  66.21,44.82 225 top
C5  62.71,45.82 45 top
C6  56.71,51.32 45 top
C7  59.21,58.82 225 top
C8  62.71,62.32 45 top
C9  69.71,72.32 0 top
C10  63.71,75.32 180 top
C11  72.71,68.32 90 top
C12  63.71,72.32 0 top
C13  69.21,75.32 0 top
C14  43.71,59.32 90 top
C15  67.71,84.32 180 top
C16  67.71,92.32 180 top
C17  73.21,84.32 0 top
C18  76.21,71.82 135 top
D1  82.71,51.32 45 top
D2  55.21,54.82 45 top
D3  108.71,30.32 315 top
D4  108.71,105.32 45 top
D5  30.21,26.82 225 top
D6  29.71,109.32 135 top
D7  95.71,26.32 35 top
D8  88.71,21.32 36 top
D9  81.21,15.82 36 top
D10  55.71,125.32 0 top
D11  52.21,113.82 0 top
D12  53.21,105.82 0 top
D13  39.71,26.32 144 top
D14  46.71,21.32 144 top
D15  54.21,15.82 144 top
D16  79.71,125.32 0 top
D17  83.21,113.82 0 top
D18  82.21,105.82 0 top
H1  87.71,79.32 0 top
H2  47.71,79.32 0 top
H3  87.71,56.32 0 top
H4  47.71,56.32 0 top
J1  49.21,47.82 90 top
J2  52.21,70.32 270 top
J3  77.21,80.32 315 top
J4  59.21,67.82 90 top
L1  DECORATIONSNEAKYSNAP  [SNEAKYSNAP_LOGO]  65.71,34.82 0 top
L2  DECORATIONSNEAKYSNAP  [SNEAKYSNAP_LOGO]  65.71,34.82 0 top
M1  112.71,22.32 45 top
M2  112.71,112.82 135 top
M3  23.21,23.32 315 top
M4  22.71,112.82 225 top
P1  9.71,125.82 0 top
P2  125.71,125.82 0 top
P3  125.71,9.82 0 top
P4  9.71,9.82 0 top
Q1  105.71,26.82 315 top
Q2  105.21,108.32 45 top
Q3  27.71,30.82 225 top
Q4  27.21,105.32 135 top
Q5  38.71,36.82 270 top
Q6  97.71,36.32 270 top
Q7  76.21,106.32 0 top
Q8  59.21,106.32 180 top
R1  44.71,66.82 270 top
R2  78.21,59.32 225 top
R3  80.71,56.82 225 top
R4  62.71,67.82 90 top
R5  63.71,78.32 180 top
R6  102.21,31.32 315 top
R7  100.71,104.82 45 top
R8  32.71,33.82 225 top
R9  30.71,100.82 135 top
R10  93.21,29.82 36 top
R11  91.21,25.32 126 top
R12  86.21,24.82 36 top
R13  83.71,20.82 126 top
R14  78.71,19.32 36 top
R15  76.21,14.82 126 top
R16  61.21,125.32 0 top
R17  54.71,121.82 180 top
R18  53.71,117.82 0 top
R19  51.71,110.32 0 top
R20  75.71,94.32 0 top
R21  49.21,106.32 90 top
R22  42.21,29.82 324 top
R23  44.21,25.32 234 top
R24  49.21,24.82 324 top
R25  51.71,20.82 234 top
R26  56.71,19.32 324 top
R27  59.21,14.82 234 top
R28  80.71,121.82 0 top
R29  83.71,110.32 0 top
R30  86.21,106.32 90 top
R31  74.21,125.32 0 top
R32  81.71,117.82 0 top
R33  75.71,90.32 0 top
R34  60.71,100.32 270 top
R35  96.71,41.32 0 top
R36  38.71,41.82 0 top
R37  74.71,100.82 90 top
R38  61.21,95.82 0 top
R39  61.21,91.32 180 top
S1  39.71,80.82 250 top
SW1  76.71,64.32 225 top
U1  67.71,55.82 135 top
U2  67.71,67.82 0 top
V1  67.71,88.32 180 top
W1  70.71,94.82 0 top
Y1  60.21,49.32 225 top
Z1  67.71,4.82 0 top

### Tracks (layer width: path | path; a pad name or v marks a point on that pad's centre or on a via)
2V5  (via drill 0.2, 0.35, 0.61)
  Top 0.254: C7.1 | v72.71,66.34 C11.1 | C9.1 v67.73,72.32 | R4.1 v62.71,65.8 | v66.61,65.32 U2.7 | 66.71,65.53 v66.61,65.32 | U2.8 67.07,65.89 66.61,65.43 v66.61,65.32 | U2.6 66.21,65.89 66.61,65.48 v66.61,65.32 | v69.21,65.32 U2.13 | U2.1 66.21,69.7 65.86,70.05 v65.21,70.05 | 67.31,70 v67.31,70.35 | 67.31,70 67.31,69.94 67.5,69.76 U2.22 | 62.96,58.07 U1.44 62.14,58.92 v62.11,58.92 | U1.59 66.86,53.21 65.8,54.27 v64.21,54.27 64.21,54.12 63.38,53.29 U1.54 | U1.23 71.66,58.74 70.86,57.94 v69.36,57.94 | v67.75,60.39 67.71,60.42 U1.34 66.56,61.61 65.83,62.33 65.83,62.62 v66.22,63.01 | v64.99,66.52 65.42,66.96 65.42,67.04 65.56,67.18 U2.5 | U2.3 65.44,68.03 65.23,67.82 v64.69,67.82 | C17.1 71.37,83.82 | v61.73,72.32 C12.1 | 67.31,70 67.07,69.76 U2.23 | R5.1 65.35,78.32 v65.69,78.66 | C7.1 v60.51,60.12 | R1.2 46.36,64.22 v51.11,64.22 | v61.21,62.7 61.21,62.56 C8.1
  Top 0.762: V1.5 68.66,84.38 C15.1 68.81,84.32 v69.91,83.82 | v69.91,83.82
  Top 0.813: 71.37,83.82 v69.91,83.82
  Route15 0.254: v64.21,54.27 63.76,54.27 60.71,57.32 60.71,58.57 60.57,59.23 | v67.75,60.39 69.36,58.78 v69.36,57.94
  pour Route15: 50.81,42.92 64.27,42.92 76.26,54.91 76.28,54.93 76.28,54.93 76.28,54.93 76.3,54.94 76.31,54.94 76.31,54.94 76.32,54.94 76.33,54.94 76.35,54.95 76.35,54.94 76.36,54.94 76.37,54.94 76.39,54.93 76.39,54.93 76.39,54.93 76.4,54.92 81.75,49.92 84.66,49.92 90.61,60.85 90.61,77.79 83.67,86.72 58.76,86.72 50.81,78.78
3  (via drill 0.35)
  Top 0.127: R6.2 102.89,37.95 94.01,46.82 94.01,53.42 98.91,58.32 98.91,63.42 92.59,69.75 88.19,69.75 J3.7
  Top 0.152: U1.49 61.21,54.62 v60.01,54.62 | R6.2 105.42,28.11 Q1.G
  Bottom 0.127: J3.7 87.27,68.82 86.51,68.82 82.81,72.52 82.81,73.36 83.76,74.3
  Bottom 0.152: v60.01,54.62 55.4,54.62 55.39,54.61 42.12,54.61 41.01,55.72 41.01,68.42 45.91,73.32 50.51,73.32 54.31,77.12 75.24,77.12 76.74,78.62 77.44,78.62 78.39,79.58 79.65,79.58 83.76,75.47 83.76,74.3
4  (via drill 0.35)
  Top 0.127: Q2.G 103.71,108.32 103.71,107.82 R7.2 101.21,105.32 101.21,95.07
  Top 0.152: v81.51,79.52 83.27,77.77 83.27,77.06 | 101.21,95.07 83.23,77.09 83.27,77.06 | U1.50 61.02,53.72 v59.91,53.72 | J3.5 84.26,73.32 84.26,76.07 83.27,77.06
  Bottom 0.152: v59.91,53.72 59.71,53.92 41.91,53.92 40.36,55.47 40.36,68.67 45.46,73.77 50.36,73.77 54.11,77.52 75.2,77.52 76.61,78.93 77.31,78.93 78.27,79.89 79.77,79.89 80.14,79.52 v81.51,79.52
5  (via drill 0.2)
  Top 0.127: Q3.G 29.21,30.82 29.71,30.82 R8.2 v32.71,33.82 | 62.21,54.32 U1.51 | 62.21,54.32 63.02,55.13 64.76,55.13 68.31,58.67 v68.31,58.98 | 62.21,54.32 v60.81,52.92
  Bottom 0.127: v32.71,33.82 33.71,34.82 | J3.4 81.54,74.94 79.21,72.61 79.21,71.09 68.59,60.47 68.59,59.27 v68.31,58.98
  Bottom 0.152: v60.81,52.92 60.16,52.92 59.75,52.51 48.85,52.51 43.91,47.57 43.91,43.04 35.7,34.82 33.71,34.82
8  (via drill 0.2, 0.35)
  Top 0.127: Q4.G 27.21,103.82 27.71,103.82 R9.2 v30.71,100.82 | U1.41 65.16,58.02 66.81,58.02 67.51,58.72 v67.51,59.42
  Top 0.152: J3.1 77.21,73.22 78.61,71.82 78.61,71.22 v77.36,69.97
  Bottom 0.127: v30.71,100.82 31.71,99.82 41.71,99.82 61.16,80.37 77.06,80.37 J3.1 | v67.51,59.42 68.31,60.22 68.31,60.92 68.96,61.57
  Bottom 0.152: v77.36,69.97 68.96,61.57
9  (via drill 0.2)
  Top 0.127: U1.40 65.27,58.62 v65.91,58.62
  Top 0.152: v83.46,54.07 83.46,54.22 92.01,54.22 92.91,53.32 92.91,47.02 93.96,45.97 93.96,45.02 R35.2 | R35.2 | Q6.G 97.66,38.2 R35.2
  Bottom 0.127: v83.46,54.07 83.46,54.47 77.41,60.52 | 68.5,58.53 68.13,58.53 68.04,58.62 v65.91,58.62
  Bottom 0.152: 77.41,60.52 77.41,61.52 78.06,62.17 78.06,63.07 75.71,65.42 74.21,65.42 69.11,60.32 69.11,59.14 68.5,58.53
19  (via drill 0.2, 0.35)
  Top 0.127: U1.19 73.11,57.21 72.03,56.12 v71.21,56.12
  Top 0.152: v53.51,57.42 49.41,53.32 45.31,53.32 43.21,51.22 43.21,44.77 40.26,41.82 R36.2 Q5.G
  Bottom 0.127: v71.21,56.12 70.27,55.18 67.38,55.18 66.84,55.72
  Bottom 0.152: v53.51,57.42 56.87,57.42 58.57,55.72 66.84,55.72
34  (via drill 0.2)
  Top 0.127: R34.2 57.22,99.37 57.16,99.42 | Q8.G 59.96,105.32 59.96,105.07 57.16,102.27 57.16,99.42 | 57.16,99.42 57.16,90.57 55.71,89.12 v55.71,82.12 | U1.42 63.71,58.82 62.51,60.02 61.61,60.02 58.31,63.32 54.51,63.32 52.21,65.62 50.41,65.62 49.41,66.62 44.01,66.62 43.51,67.12 43.51,69.08 48.01,73.58 48.17,73.58 v54.31,79.72
  Bottom 0.127: v55.71,82.12 55.71,81.12 v54.31,79.72
35  (via drill 0.2)
  Top 0.127: 73.21,103.32 72.96,103.57 72.96,105.57 74.46,107.07 75.21,107.07 Q7.G | 73.21,103.32 74.71,101.82 R37.2 | 73.21,103.32 73.21,83.57 71.79,82.15 71.79,62.29 71.84,62.24 | U1.43 63.4,58.39 64.08,57.71 v64.34,57.71
  Top 0.152: 71.84,62.24 72.21,61.86 v72.21,61.82
  Bottom 0.127: 72.71,58.4 69.14,58.4 68.45,57.71 v64.34,57.71
  Bottom 0.152: 72.71,58.4 74.11,59.8 74.11,59.82 72.21,61.72 v72.21,61.82
A2  (via drill 0.61)
  Top 0.254: R39.2 60.26,87.88 v60.31,87.82 | v46.91,51.82 46.61,51.82 45.01,50.22 45.01,43.62 46.01,42.62 51.11,42.62 51.11,44.02 51.41,44.32 59.41,44.32 62.51,41.22 65.71,41.22 68.31,43.82 68.31,46.82 69.41,47.92 69.41,48.82 U1.1
  Route15 0.254: v60.31,87.82 58.81,87.82 49.71,78.72 49.71,54.62 v46.91,51.82
ADRV
  Top 0.5: 75.71,49.43 B1.1
  Top 1.27: 75.71,49.43 76.85,48.29 C2.1 77.08,47.96 A1.FEED
BAT_GND  (via drill 0.61)
  Top 0.127: 70.21,94.82 W1.1
  Top 0.762: v61.45,107.27 Q8.S | C14.2 v43.71,63.14 | Q6.S 95.2,37.4 v95.16,37.36 | Q5.S 37.96,38.06 38.04,38.13 v38.04,39.28 | Q7.S v73.98,105.37 | v27.01,22.62 26.96,22.58 M3.G2 | M3.G1 22.38,26.98 22.41,27.02 v22.41,27.12 | v113.41,26.42 115.1,24.73 M1.G2 | v108.81,21.82 110.51,20.13 M1.G1 | M2.G2 108.89,113.49 v108.81,113.42 | M2.G1 114.76,110.58 v113.21,109.02 | M4.G2 v22.02,109.03 v22.01,109.02 | 24.96,114.87 | 24.96,114.87 M4.G1 26.61,113.41 v26.61,113.32 | Q4.S 28.6,105.28 v29.51,104.32 29.71,104.26 29.71,104.07 | Q2.S 105.17,106.93 v104.21,106.02 | Q1.S v103.41,27.72 | Q3.S v28.71,33.12 | V1.2 67.57,89.77 67.57,90.44 66.82,91.2 C16.2 v65.61,92.32 | 68.71,96.32 B3.G | 70.71,101.57 B3.G2 70.91,100.71 B3.2 68.98,96.39 B3.G | 42.71,82.57 42.96,82.32 S1.A v43.71,83.82 | B3.G 70.01,94.82 70.21,94.82 | B3.G3 65.86,101.77 v65.91,101.82
  Route2 0.762: J3.9 91.62,66.12 93.11,66.12
  Bottom 0.762: v95.16,37.36 94.61,37.53
  pour Route2: 58.67,88.89 58.7,88.9 83.7,88.9 83.71,88.9 83.72,88.9 83.73,88.9 83.73,88.9 83.74,88.9 83.75,88.89 83.76,88.89 83.76,88.89 83.76,88.88 83.77,88.88 83.78,88.87 83.78,88.86 92.77,77.88 92.78,77.87 92.78,77.86 92.78,77.86 92.79,77.85 92.79,77.84 92.79,77.84 92.79,77.83 92.79,77.82 92.79,59.83 92.79,59.82 92.79,59.82 92.79,59.81 92.79,59.8 92.79,59.79 92.78,59.79 92.78,59.78 92.77,59.78 88.79,53.8 88.79,33.83 88.79,33.83 88.79,33.82 88.79,33.81 88.79,33.8 88.79,33.8 88.78,33.79 88.78,33.78 88.77,33.78 88.77,33.77 88.76,33.77 88.76,33.76 88.75,33.76 68.79,19.74 68.79,-2.64 69.75,-3.6 106.18,-3.6 137.64,27.86 137.64,108.79 108.18,138.25 27.75,138.25 1.29,111.79 1.29,27.86 36.25,-7.1 62.68,-7.1 63.14,-6.64 63.14,20.29 48.65,34.78 48.64,34.81 48.64,78.84 48.65,78.87
GND  (via drill 0.2)
  Top 0.254: R9.1 v32.17,99.37 | D1.C 83.41,52.07 | R7.1 v99.26,103.37 | 54.77,67.77 J2.6 | v100.76,32.88 100.73,32.81 R6.1 | R8.1 v34.17,35.28 | R35.1 v94.79,41.22 | v55.37,59.88 C3.2 56.39,60.9 | D2.C v57.09,56.5 | 70.6,51.84 U1.7 | U1.61 67,51.92 v67.11,51.92 | U1.20 71.9,56.82 71.82,56.82 v71.8,56.8 | U1.55 63.77,52.9 64.39,53.52 64.91,53.52 65.5,52.94 65.5,52.54 U1.58 | 68.83,69.8 68.93,69.9 69.08,69.9 69.21,69.76 69.22,69.62 | 70.16,68.47 U2.17 | 70.16,68.47 70.21,68.47 70.01,68.26 70.01,68.17 69.89,68.06 69.87,68.06 69.84,68.04 U2.16 | U2.15 70.26,67.62 70.01,67.36 70.01,67.31 69.87,67.18 U2.14 | 68.83,69.8 68.75,69.8 68.65,69.9 68.5,69.9 68.36,69.76 U2.20 | U2.18 69.22,69.62 | 70.16,68.47 70.16,69.97 69.71,70.12 69.22,69.62 | 68.83,69.8 68.79,69.76 U2.19 | v34.17,35.28 | 69.98,57.33 69.09,57.33 68.85,57.57 68.85,58.15 69.15,58.45 70.7,58.45 U1.24 | C7.2 v57.81,57.42 | U1.45 63.61,56.74 v63.61,56.72 | U1.35 v65.11,62.31 v65.11,62.32 | U1.33 67.41,62.42 | C5.2 | C6.2
  Route2 0.254: v67.11,51.92 67.01,51.92 65.91,53.03 v65.91,53.07
  Bottom 0.254: 69.98,57.33 70.4,56.91 71.54,56.91 71.65,56.8 v71.8,56.8
  pour Route2: 50.79,42.9 64.38,42.9 76.33,54.85 76.34,54.86 76.34,54.86 76.34,54.86 76.36,54.87 76.37,54.87 76.37,54.87 76.37,54.87 76.39,54.87 76.4,54.87 76.4,54.87 76.4,54.87 76.41,54.87 76.43,54.86 76.43,54.86 76.43,54.86 76.44,54.85 81.74,49.9 84.67,49.9 90.64,60.84 90.64,77.8 83.68,86.75 58.75,86.75 50.79,78.79
  pour Bottom: 87.28,31.78 87.26,31.76 87.23,31.75 82.25,31.75 68.79,18.29 68.79,-2.64 69.75,-3.6 151.68,-3.6 163.64,8.36 163.64,137.29 144.18,156.75 6.75,156.75 -10.21,139.79 -10.21,-3.64 -0.25,-13.6 55.18,-13.6 66.14,-2.64 66.14,34.84 66.15,34.87 79.64,48.36 79.64,48.84 79.65,48.87 79.67,48.89 79.7,48.9 79.73,48.9 79.76,48.89 87.28,41.37 87.29,41.34 87.29,31.81
  pour Top: 165.14,7.86 165.14,166.25 139.2,166.25 139.17,166.26 138.68,166.75 14.75,166.75 -13.71,138.29 -13.71,-4.14 15.25,-33.1 40.68,-33.1 67.14,-6.64 67.14,29.29 63.9,32.53 63.89,32.56 63.89,32.59 63.9,32.62 79.14,47.86 79.14,48.84 79.15,48.87 79.17,48.89 79.2,48.9 80.23,48.9 80.26,48.89 88.28,40.87 88.29,40.84 88.29,31.81 88.28,31.78 87.76,31.26 87.73,31.25 84.25,31.25 69.79,16.79 69.79,-4.69 69.78,-4.72 67.9,-6.6 150.68,-6.6
MISO
  Top 0.127: J2.1 47.75,72.86 47.31,72.42 47.31,69.62 48.11,68.82 51.51,68.82 51.81,68.52 51.81,66.52 54.74,63.6 58.53,63.6 61.44,60.69 63.28,60.69 63.31,60.72 63.88,60.72 U1.39
MOSI
  Top 0.127: U1.38 64.96,60.32 64.21,61.07 63.77,61.07 60.92,63.92 57.81,63.92 55.01,63.92 52.31,66.62 52.31,68.52 54.11,70.32 J2.4
N$1
  Top 0.127: V1.3 58.21,81.07 44.46,81.07 43.46,80.07 42.46,80.07 S1.C
N$3
  Top 0.127: C1.2 B1.2
N$5
  Top 0.127: C4.1 66.71,45.57 64.71,47.57 64.71,50.32 65.46,51.07 U1.60
N$6  (via drill 0.2)
  Top 0.127: 71.21,57.57 71.96,58.32 U1.22 | C3.1 57.46,61.82 58.36,60.92 58.79,60.92 v59.2,60.51 | 71.21,57.57 71.39,57.4 71.76,57.4 U1.21 | 71.21,57.57 71.19,57.55 71.19,57.44 70.03,56.29 69.14,56.29 68.36,57.07 v68.06,57.07
  Bottom 0.127: v59.2,60.51 59.3,60.51 62.64,57.17 63.8,57.17 63.9,57.07 v68.06,57.07
N$7
  Top 0.152: C5.1 60.07,47.2 Y1.3 59.72,48.3 62.52,51.11 63.35,51.11 U1.57
N$8
  Top 0.152: C6.1 59.96,50.69 Y1.1 62.98,51.44 U1.56
N$9  (via drill 0.2)
  Top 0.127: v76.96,59.82 78.71,59.82 R2.1 | v55.21,55.07 55.21,54.81 D2.A
  Bottom 0.127: v76.96,59.82 76.36,59.82 71.44,54.9 60.47,54.9 60.23,55.14 59.8,55.14 59.74,55.08 v55.21,55.08 v55.21,55.07
N$10
  Top 0.254: R3.1 81.39,51.16 D1.A
N$11
  Top 0.762: 108.46,27.82 106.71,26.07 Q1.D | 108.46,27.82 109.71,29.07 D3.2 | M1.2 111.18,24.86 108.71,27.32 108.71,27.57 108.46,27.82
N$12
  Top 0.2: C10.1 66.21,73.72 66.21,70.24 66.64,69.81 U2.24
N$13
  Top 0.762: 108.21,108.07 107.46,108.82 106.21,108.82 106.21,109.07 Q2.D | 108.21,108.07 109.71,106.57 D4.2 | M2.2 110.21,111.07 108.46,109.32 108.46,108.32 108.21,108.07
N$14
  Top 0.127: C13.1 66.78,74.09 66.78,71.94 67.93,70.79 U2.21
N$15
  Top 0.762: 27.96,27.57 26.96,28.57 26.96,29.82 Q3.D | 27.96,27.57 29.21,26.32 D5.2 | M3.2 25.71,25.07 27.71,27.07 27.71,27.32 27.96,27.57
N$16
  Top 0.762: 26.46,108.32 26.21,108.07 26.21,106.32 Q4.D | 26.46,108.32 28.46,110.32 D6.2 | 26.46,108.32 24.46,110.32 M4.2
N$17
  Top 0.127: D10.3 54.96,124.82 55.71,124.07 55.71,121.82 R17.1
N$18
  Top 0.127: D7.3 95.21,25.32 94.71,25.32 94.46,25.07 91.96,25.07 91.96,24.57 R11.1
N$19  (via drill 0.2)
  Top 0.127: 84.71,110.32 84.71,108.82 86.21,107.32 R30.2 | 84.71,110.32 84.71,111.07 v83.21,112.57 83.21,114.82 81.71,116.32 81.71,121.82 R28.2 | 84.71,110.32 R29.2 | 50.71,108.82 52.46,110.57 52.71,110.57 52.71,110.32 | 50.71,108.82 49.21,107.32 R21.2 | 50.71,108.82 49.71,109.82 49.71,114.32 51.21,115.82 51.21,119.32 53.71,121.82 R17.2 | 52.71,110.32 52.71,110.07 54.21,110.07 57.96,106.32 Q8.D v59.71,106.32 | 52.71,110.32 R19.2
  Bottom 0.127: v83.21,112.57 76.96,106.32 v59.71,106.32
N$20  (via drill 0.2, 0.61)
  Top 0.127: R14.2 79.71,20.07 84.96,25.32 86.96,25.32 R12.2 87.21,25.32 87.21,24.82 90.71,24.82 91.71,25.82 91.71,26.82 91.21,27.32 v91.21,30.32 93.96,30.32 R10.2 | 42.36,32.32 42.36,29.92 42.96,29.32 R22.2 43.67,29.81 v43.67,30.07 | v56.71,19.57 57.46,18.82 R26.2 | v50.71,23.57 50.21,24.07 R24.2
  Top 0.152: Q5.D 39.01,35.67 42.36,32.32
  Top 0.254: R10.2 95.33,30.44 v96.21,31.32
  Bottom 0.127: v56.71,19.57 52.71,23.57 v50.71,23.57 50.46,23.57 43.96,30.07 | 43.96,30.07 43.16,30.87 43.16,37.99 44.86,39.69 44.86,39.78 47.8,42.72 v52.51,42.72 | 43.96,30.07 v43.67,30.07
  Bottom 0.152: v52.51,42.72 52.51,44.19 58.25,49.92 62.11,49.92 66.01,53.82 72.11,53.82 75.81,57.52 77.91,57.52 83.31,52.12 89.31,52.12 89.81,51.62 89.81,40.32 91.01,39.12 91.11,39.12 91.21,39.02 v91.21,30.32
N$21
  Top 0.127: R10.1 92.46,29.07 94.46,27.07 94.46,26.32 D7.2
N$22  (via drill 0.2, 0.61)
  Top 0.127: 50.96,19.57 50.96,19.82 R25.2 | 50.96,19.57 50.96,16.57 51.46,16.07 51.46,15.82 52.21,15.82 54.21,13.82 58.46,13.82 R27.2 | 50.96,19.57 46.21,19.57 43.71,22.07 43.71,24.32 R23.2 43.46,24.57 43.46,28.32 44.41,29.27 v44.41,39.87 | 78.46,19.82 78.71,19.82 78.71,19.57 79.46,18.82 82.96,18.82 82.96,21.57 R13.2 | 78.46,19.82 77.71,19.82 76.71,18.82 76.71,15.82 75.71,15.82 R15.2 | 90.71,32.57 90.71,26.32 R11.2 | 92.91,34.77 90.71,32.57 | 78.46,19.82 78.46,20.32 90.71,32.57
  Top 0.152: v91.21,52.93 91.21,47.62 92.91,45.92 92.91,34.77 97.31,34.77 Q6.D
  Bottom 0.127: v44.41,39.87 44.75,40.21 44.75,43.31 52.28,50.84 61.46,50.84 65.04,54.42 71.81,54.42 | v91.21,52.93 83.4,52.93 78.27,58.07
  Bottom 0.152: 78.27,58.07 78.11,58.22 75.61,58.22 71.81,54.42
N$23
  Top 0.127: 79.71,120.57 77.96,120.57 77.96,122.07 75.46,124.57 75.46,125.32 R31.2 | 79.71,120.57 79.96,120.57 80.71,121.32 80.71,123.07 81.96,123.07 82.71,122.32 82.71,117.82 R32.2 | 54.96,117.82 57.46,120.32 57.46,121.57 60.21,124.32 62.21,124.32 62.21,125.32 R16.2 | R33.2 76.71,90.32 76.71,94.32 R20.2 76.96,94.32 76.96,106.07 | 76.96,106.07 77.21,106.32 Q7.D | 54.96,117.82 54.96,115.07 55.21,114.82 55.21,113.07 54.71,112.57 54.71,111.57 57.96,108.32 76.96,108.32 76.96,106.82 | 76.96,106.07 76.96,106.82 | 54.96,117.82 R18.2 | 76.96,106.07 Q7.D | 79.71,120.57 79.71,115.32 80.71,114.32 80.71,110.57 76.96,106.82 | 76.96,106.82 Q7.D
N$24
  Top 0.127: D8.3 88.21,20.32 87.71,20.32 87.21,19.82 84.46,19.82 R13.1
N$25  (via drill 0.2)
  Top 0.127: v75.96,69.82 77.07,70.93 C18.1 | J1.1 51.71,52.65 51.71,53.87 v57.85,60.01
  Bottom 0.127: v75.96,69.82 73.21,67.07 71.96,67.07 68.3,63.41 66.45,63.41 66.4,63.45 61.02,63.45 58.36,60.79 58.36,60.51 v57.85,60.01
N$26
  Top 0.127: R12.1 85.46,24.07 87.71,21.82 87.71,21.32 D8.2
N$27  (via drill 0.2)
  Top 0.127: v41.46,26.82 40.96,26.32 D13.3 | v43.96,25.57 44.71,26.32 R23.1
  Bottom 0.127: v41.46,26.82 42.71,25.57 v43.96,25.57
N$28
  Top 0.127: D9.3 80.71,14.82 80.21,14.82 79.96,14.57 76.96,14.57 76.96,14.07 R15.1
N$29
  Top 0.127: D10.2 54.96,125.82 55.46,125.82 55.46,126.07 56.21,126.82 59.96,126.82 59.96,125.32 R16.1
N$30
  Top 0.127: R14.1 77.96,18.57 80.21,16.32 80.21,15.82 D9.2
N$31
  Top 0.127: D13.2 40.21,25.32 41.21,25.32 41.96,26.07 41.96,30.07 41.46,30.57 R22.1
N$32
  Top 0.127: D14.3 47.71,21.32 47.71,24.57 47.21,25.07 47.21,25.57 48.21,26.57 51.46,26.57 51.46,22.32 52.21,21.57 R25.1
N$33
  Top 0.127: D11.3 51.21,113.32 50.71,112.82 50.71,110.32 R19.1
N$34
  Top 0.127: D11.2 51.46,114.32 52.46,115.32 52.46,117.82 R18.1
N$35
  Top 0.127: D12.3 52.21,105.32 49.21,105.32 R21.1
N$36  (via drill 0.2)
  Top 0.127: v53.21,107.07 52.46,106.32 D12.2 | v74.21,95.32 74.46,95.07 74.46,94.32 R20.1
  Bottom 0.127: v53.21,107.07 64.96,95.32 v74.21,95.32
N$37
  Top 0.127: D14.2 47.21,20.32 48.21,20.32 48.71,20.82 48.71,24.82 48.46,25.07 48.46,25.32 R24.1
N$38
  Top 0.127: D15.3 55.21,15.82 55.21,19.07 54.71,19.57 54.71,20.07 55.71,21.07 57.46,21.07 57.46,20.32 59.96,17.82 59.96,15.82 R27.1
N$39
  Top 0.127: D15.2 54.71,14.82 55.71,14.82 56.21,15.32 56.21,19.32 55.96,19.57 55.96,19.82 R26.1
N$40
  Top 0.127: D16.3 78.96,124.82 79.71,124.07 79.71,121.82 R28.1
N$41
  Top 0.127: D17.3 82.46,113.32 82.71,113.07 82.71,110.32 R29.1
N$42
  Top 0.127: R30.1 86.21,104.32 82.71,104.32 81.96,105.07 81.96,105.32 81.46,105.32 D18.3
N$43
  Top 0.127: D16.2 78.71,125.82 77.4,127.13 73.48,127.13 73.13,126.79 73.13,125.55 R31.1
N$44
  Top 0.127: D17.2 82.21,114.32 80.71,115.82 80.71,117.82 R32.1
N$45
  Top 0.127: R33.1 74.71,90.32 75.71,89.32 78.71,89.32 78.71,104.32 80.71,106.32 81.21,106.32 D18.2
PG0
  Top 0.127: R2.2 77.46,58.57 75.21,56.32 75.21,54.32 74.46,53.57 73.96,53.57 73.21,54.32 U1.14
PG1
  Top 0.127: R3.2 79.96,56.32 79.96,60.07 78.96,61.07 77.59,61.07 76.51,59.99 76.51,59.7 74.96,58.16 74.96,56.57 74.71,56.32 74.71,54.32 74.46,54.07 73.96,54.07 73.46,54.57 U1.15
RESET  (via drill 0.2, 0.35)
  Top 0.127: R1.1 44.71,67.82 49.21,67.82 J2.5 v50.96,66.47 | C18.2 75.46,72.32 75.46,69.57 77.63,67.41 78.2,67.43 | U1.12 72.21,53.82 70.41,55.62 v67.88,55.62 v67.87,55.63
  Top 0.152: SW1.1 78.2,67.43 | v74.31,64.12 73.11,62.92 SW1.2
  Bottom 0.127: 68.46,56.22 63.27,56.22 63.15,56.34 59.8,56.34 59.69,56.46 59.69,57.55 57.41,59.83 57.41,60.03 v50.96,66.47 | 68.46,56.22 70.69,56.22 71.03,56.57 71.4,56.57 71.61,56.36 71.98,56.36 76.23,60.61 v76.23,63.04 | 68.46,56.22 v67.87,55.63
  Bottom 0.152: v76.23,63.04 76.23,63.1 75.21,64.12 v74.31,64.12
RF_N
  Top 0.152: U1.9 73.17,50.72 73.95,50.72 B1.3
RF_P
  Top 0.152: U1.8 71.01,52.2 72.82,50.38 72.82,49.59 B1.4 | U1.8
RX0
  Top 0.127: U1.46 62.21,57.32 61.21,58.32 59.96,58.32 59.96,56.82 51.71,48.57 51.71,46.92 J1.3
SCK
  Top 0.127: U1.37 65.46,60.57 64.34,61.69 64.34,63.69 63.31,64.72 58.21,64.72 57.11,65.82 57.11,71.12 56.61,71.62 50.97,71.62 J2.3
SCL  (via drill 0.2, 0.35)
  Top 0.127: R5.2 62.26,78.32 61.26,77.32 61.26,73.37 60.46,72.57 60.46,71.57 59.21,70.32 J4.2 60.06,69.52 64.02,69.52 65.07,68.47 U2.2 | 71.21,59.57 U1.25
  Top 0.152: v67.51,63.92 68.55,63.92 v71.01,61.46 | v72.91,60.12 72.82,60.03 71.67,60.03 71.21,59.57
  Bottom 0.127: J4.2 59.21,70.57 59.46,70.82 69.46,70.82 76.97,78.33 77.56,78.33 77.75,78.53 J3.2
  Bottom 0.152: J4.2 57.81,68.96 57.81,64.62 58.31,64.12 63.31,64.12 64.31,65.12 64.61,65.12 65.71,64.02 67.41,64.02 v67.51,63.92 | v71.01,61.46 71.32,61.16 71.32,60.76 71.95,60.12 v72.91,60.12
SDA  (via drill 0.2)
  Top 0.127: R4.2 62.71,67.82 | 62.71,67.82 62.71,67.57 63.91,67.57 63.91,66.97 64.11,66.97 | 71.31,60.42 70.71,59.82 U1.26 | 62.71,67.82 J4.1 | 64.11,66.97 64.11,66.27 65.81,64.57 68.63,64.57 | U2.4 65.92,67.54 65.44,67.54 64.87,66.97 64.11,66.97 | 84.16,62.32 84.36,62.32 J3.8
  Top 0.152: 84.16,62.32 74.31,62.32 73.14,61.15 v71.87,61.15 | 71.31,60.42 71.87,60.98 v71.87,61.15 | v71.87,61.15 71.87,61.35 71.61,61.61 71.61,61.62 68.66,64.57 68.63,64.57
TX0
  Top 0.127: U1.47 61.96,57.07 61.21,57.82 60.46,57.82 60.46,56.82 53.21,49.57 53.21,45.82 52.71,45.32 47.96,45.32 47.96,44.68 J1.4
VBAT  (via drill 0.61)
  Top 0.762: D3.1 v106.71,32.33 | D3.1 | D16.1 v81.82,125.8 | D4.1 v106.71,103.32 | D4.1 | v32.31,28.94 32.1,28.73 32.02,28.63 D5.1 31.38,28.32 | D10.1 v57.82,125.8 | D10.4 v58.88,124.85 | D12.1 v55.32,106.3 | D12.4 v56.38,105.35 | D6.1 v31.72,107.32 | D6.1 | v43.71,55.51 C14.1 43.46,57.57 | D11.1 v54.32,114.3 | D17.1 v85.32,114.3 | D18.1 v84.32,106.3 | D16.4 v81.82,124.85 | D11.4 v54.32,113.35 | D17.4 v85.32,113.35 | D18.4 v84.32,105.35 | M3.1 v25.91,26.92 | v37.61,27.22 D13.1 38.96,26.57 38.96,26.82 39.21,27.07 D13.4 | v44.61,22.22 D14.1 45.96,21.57 45.96,21.82 46.21,22.07 D14.4 | v52.11,16.72 D15.1 53.46,16.07 53.46,16.32 53.71,16.57 D15.4 | v83.31,16.72 D9.4 81.96,16.07 81.96,16.32 81.71,16.57 D9.1 | v90.71,22.22 D8.4 89.46,21.57 89.46,21.82 89.21,22.07 D8.1 | v97.81,27.22 D7.4 96.46,26.57 96.46,26.82 96.21,27.07 D7.1 | v109.11,25.22 110.3,24.04 M1.1 | M2.1 v110.01,109.22 | M4.1 v26.31,110.22 | V1.1 68.66,92.27 C16.1 v69.81,92.32 | B3.P 66.71,98.32 66.46,98.57 B3.1 | S1.B v43.21,76.82 | R38.2 62.17,94.58 v62.11,94.52 | R39.1 62.17,92.57 v62.11,92.62
  Route15 0.762: v106.71,103.32 106.46,103.07 | 93.21,71.52 86.21,71.52 J3.6
  pour Route15 (rank 4): 58.67,88.89 58.7,88.9 83.7,88.9 83.71,88.9 83.72,88.9 83.73,88.9 83.73,88.9 83.74,88.9 83.75,88.89 83.76,88.89 83.76,88.89 83.76,88.88 83.77,88.88 83.78,88.87 83.78,88.86 92.77,77.88 92.78,77.87 92.78,77.86 92.78,77.86 92.79,77.85 92.79,77.84 92.79,77.84 92.79,77.83 92.79,77.82 92.79,59.83 92.79,59.82 92.79,59.82 92.79,59.81 92.79,59.8 92.79,59.79 92.78,59.79 92.78,59.78 92.77,59.78 88.79,53.8 88.79,33.83 88.79,33.83 88.79,33.82 88.79,33.81 88.79,33.8 88.79,33.8 88.78,33.79 88.78,33.78 88.77,33.78 88.77,33.77 88.76,33.77 88.76,33.76 88.75,33.76 69.79,19.79 69.79,-1.14 70.75,-2.1 105.18,-2.1 135.64,28.36 135.64,108.79 107.68,136.75 27.75,136.75 2.29,111.29 2.29,26.86 35.25,-6.1 64.54,-6.1 64.54,16.89 48.65,32.78 48.64,32.81 48.64,78.84 48.65,78.87
(copper drawn outside any net)
  shapes: Bottom area x1, Route15 area x1, Route2 area x1, Top area x2

### Text on the board
tPlace: Pin 4 | Pin 8 | Pin 8 | SCL | 2V5 | Pin 5 | Pin 4 | VBAT | Pin 3 | SDA | BAT_GND | GND | Pin 5 | Pin 3
bPlace: Pin 4 | Pin 8 | Pin 8 | SCL | 2V5 | Pin 5 | Pin 4 | VBAT | Pin 3 | SDA | BAT_GND | GND | Pin 5 | Pin 3